# EAGLE design SpeedOfLightController (EAGLE 9.5.1)

## Sheet 1 of 5
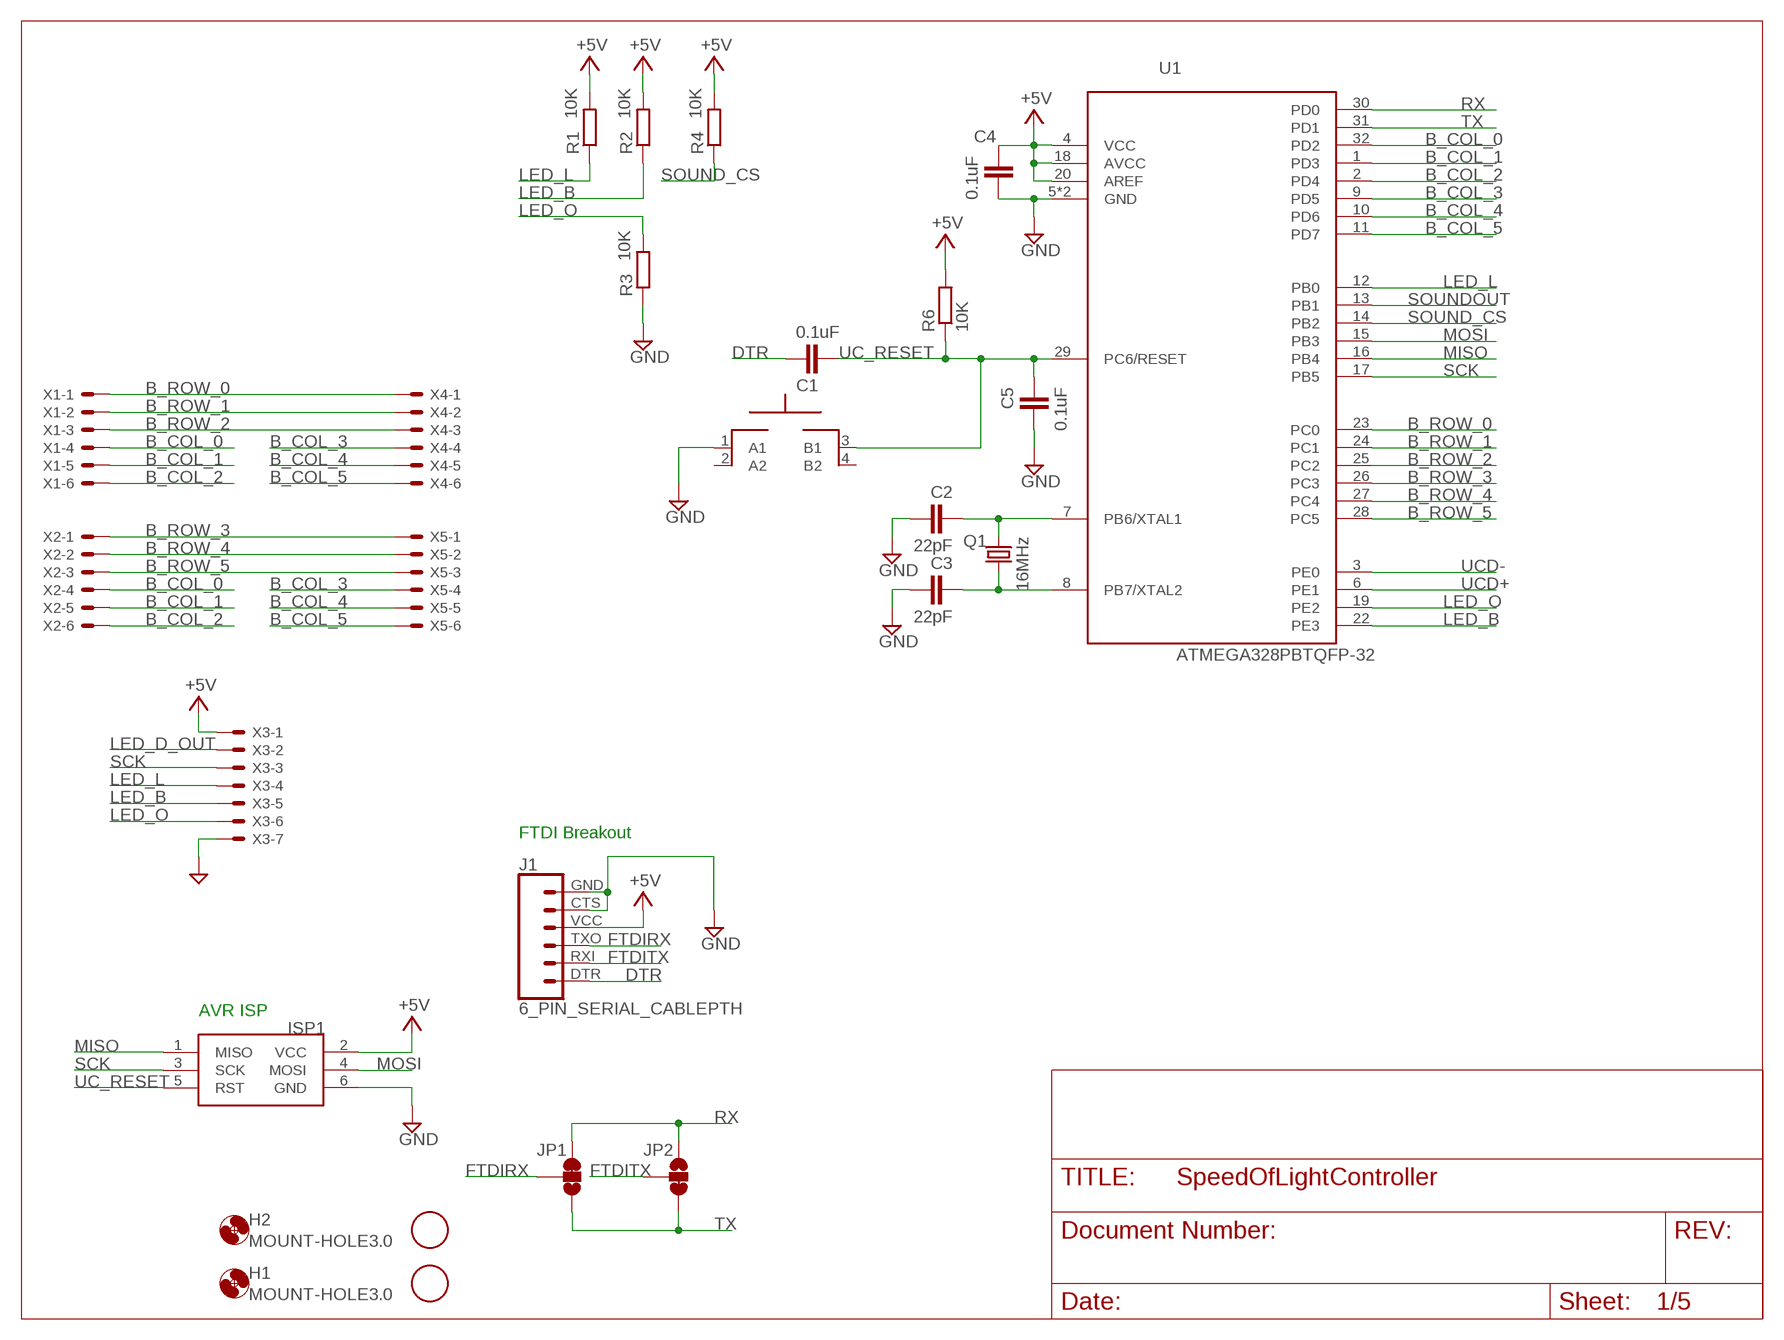
[diagram p0: schematic, sheet 1]

### Parts
AF1  FIDUCIAL  [FIDUCIAL_1MM]
AF2  FIDUCIAL  [FIDUCIAL_1MM]
C1  0.1uF  C-EUC0805  [C0805]
C2  22pF  C-EUC0805  [C0805]
C3  22pF  C-EUC0805  [C0805]
C4  0.1uF  C-EUC0805  [C0805]
C5  0.1uF  C-EUC0805  [C0805]
H1  MOUNT-HOLE3.0  [3,0]
H2  MOUNT-HOLE3.0  [3,0]
ISP1  AVRISP-6  [AVRISP]
J1  6_PIN_SERIAL_CABLEPTH  [FTDI_BASIC]
JP1  JUMPER-SMT_3_1-NC_TRACE_SILK  [SMT-JUMPER_3_1-NC_TRACE_SILK]
JP2  JUMPER-SMT_3_1-NC_TRACE_SILK  [SMT-JUMPER_3_1-NC_TRACE_SILK]
Q1  16MHz  CRYSTALHC49UP  [HC49UP]
R1  10K  R-EU_R0805  [R0805]
R2  10K  R-EU_R0805  [R0805]
R3  10K  R-EU_R0805  [R0805]
R4  10K  R-EU_R0805  [R0805]
R6  10K  R-EU_R0805  [R0805]
RESET  MOMENTARYBUTTON  [SPST_NO_SMD]
U1  ATMEGA328PBTQFP-32  [QFP80P900X900X120-32N]
X1  JST-XH-06-PIN-LONG-PAD  [JST-XH-06-PACKAGE-LONG-PAD]
X2  JST-XH-06-PIN-LONG-PAD  [JST-XH-06-PACKAGE-LONG-PAD]
X3  JST-XH-07-PIN-LONG-PAD  [JST-XH-07-PACKAGE-LONG-PAD]
X4  JST-XH-06-PIN-LONG-PAD  [JST-XH-06-PACKAGE-LONG-PAD]
X5  JST-XH-06-PIN-LONG-PAD  [JST-XH-06-PACKAGE-LONG-PAD]

### Nets
+5V: C4.2 ISP1.2(VCC) J1.VCC R1.2 R2.2 R4.2 R6.2 U1.4(VCC) U1.18(AVCC) U1.20(AREF) X3.1 ; also sheet 2,4,5
B_COL_0: U1.32(PD2) X1.4 X2.4
B_COL_1: U1.1(PD3) X1.5 X2.5
B_COL_2: U1.2(PD4) X1.6 X2.6
B_COL_3: U1.9(PD5) X4.4 X5.4
B_COL_4: U1.10(PD6) X4.5 X5.5
B_COL_5: U1.11(PD7) X4.6 X5.6
B_ROW_0: U1.23(PC0) X1.1 X4.1
B_ROW_1: U1.24(PC1) X1.2 X4.2
B_ROW_2: U1.25(PC2) X1.3 X4.3
B_ROW_3: U1.26(PC3) X2.1 X5.1
B_ROW_4: U1.27(PC4) X2.2 X5.2
B_ROW_5: U1.28(PC5) X2.3 X5.3
DTR: C1.2 J1.DTR
FTDIRX: J1.TXO JP1.2
FTDITX: J1.RXI JP2.2
GND: C2.1 C3.1 C4.1 C5.1 ISP1.6(GND) J1.CTS J1.GND R3.1 RESET.1(A1) U1.5(GND) U1.21(GND) X3.7 ; also sheet 2,3,4,5
LED_B: R2.1 U1.22(PE3) X3.5 ; also sheet 2
LED_D_OUT: X3.2 ; also sheet 2
LED_L: R1.1 U1.12(PB0) X3.4 ; also sheet 2
LED_O: R3.2 U1.19(PE2) X3.6 ; also sheet 2
MISO: ISP1.1(MISO) U1.16(PB4) ; also sheet 4
MOSI: ISP1.4(MOSI) U1.15(PB3) ; also sheet 2,4
N$17: C2.2 Q1.1 U1.7(PB6/XTAL1)
N$18: C3.2 Q1.2 U1.8(PB7/XTAL2)
RX: JP1.3 JP2.1 U1.30(PD0)
SCK: ISP1.3(SCK) U1.17(PB5) X3.3 ; also sheet 2,4
SOUND_CS: R4.1 U1.14(PB2) ; also sheet 4
SOUNDOUT: U1.13(PB1) ; also sheet 4
TX: JP1.1 JP2.3 U1.31(PD1)
UC_RESET: C1.1 C5.2 ISP1.5(RST) R6.1 RESET.3(B1) U1.29(PC6/RESET)
UCD+: U1.6(PE1) ; also sheet 5
UCD-: U1.3(PE0) ; also sheet 5
Unconnected: RESET.2(A2) RESET.4(B2)

### Notes on the sheet
- FTDI Breakout
- AVR ISP

## Sheet 2 of 5: ScoreBoard
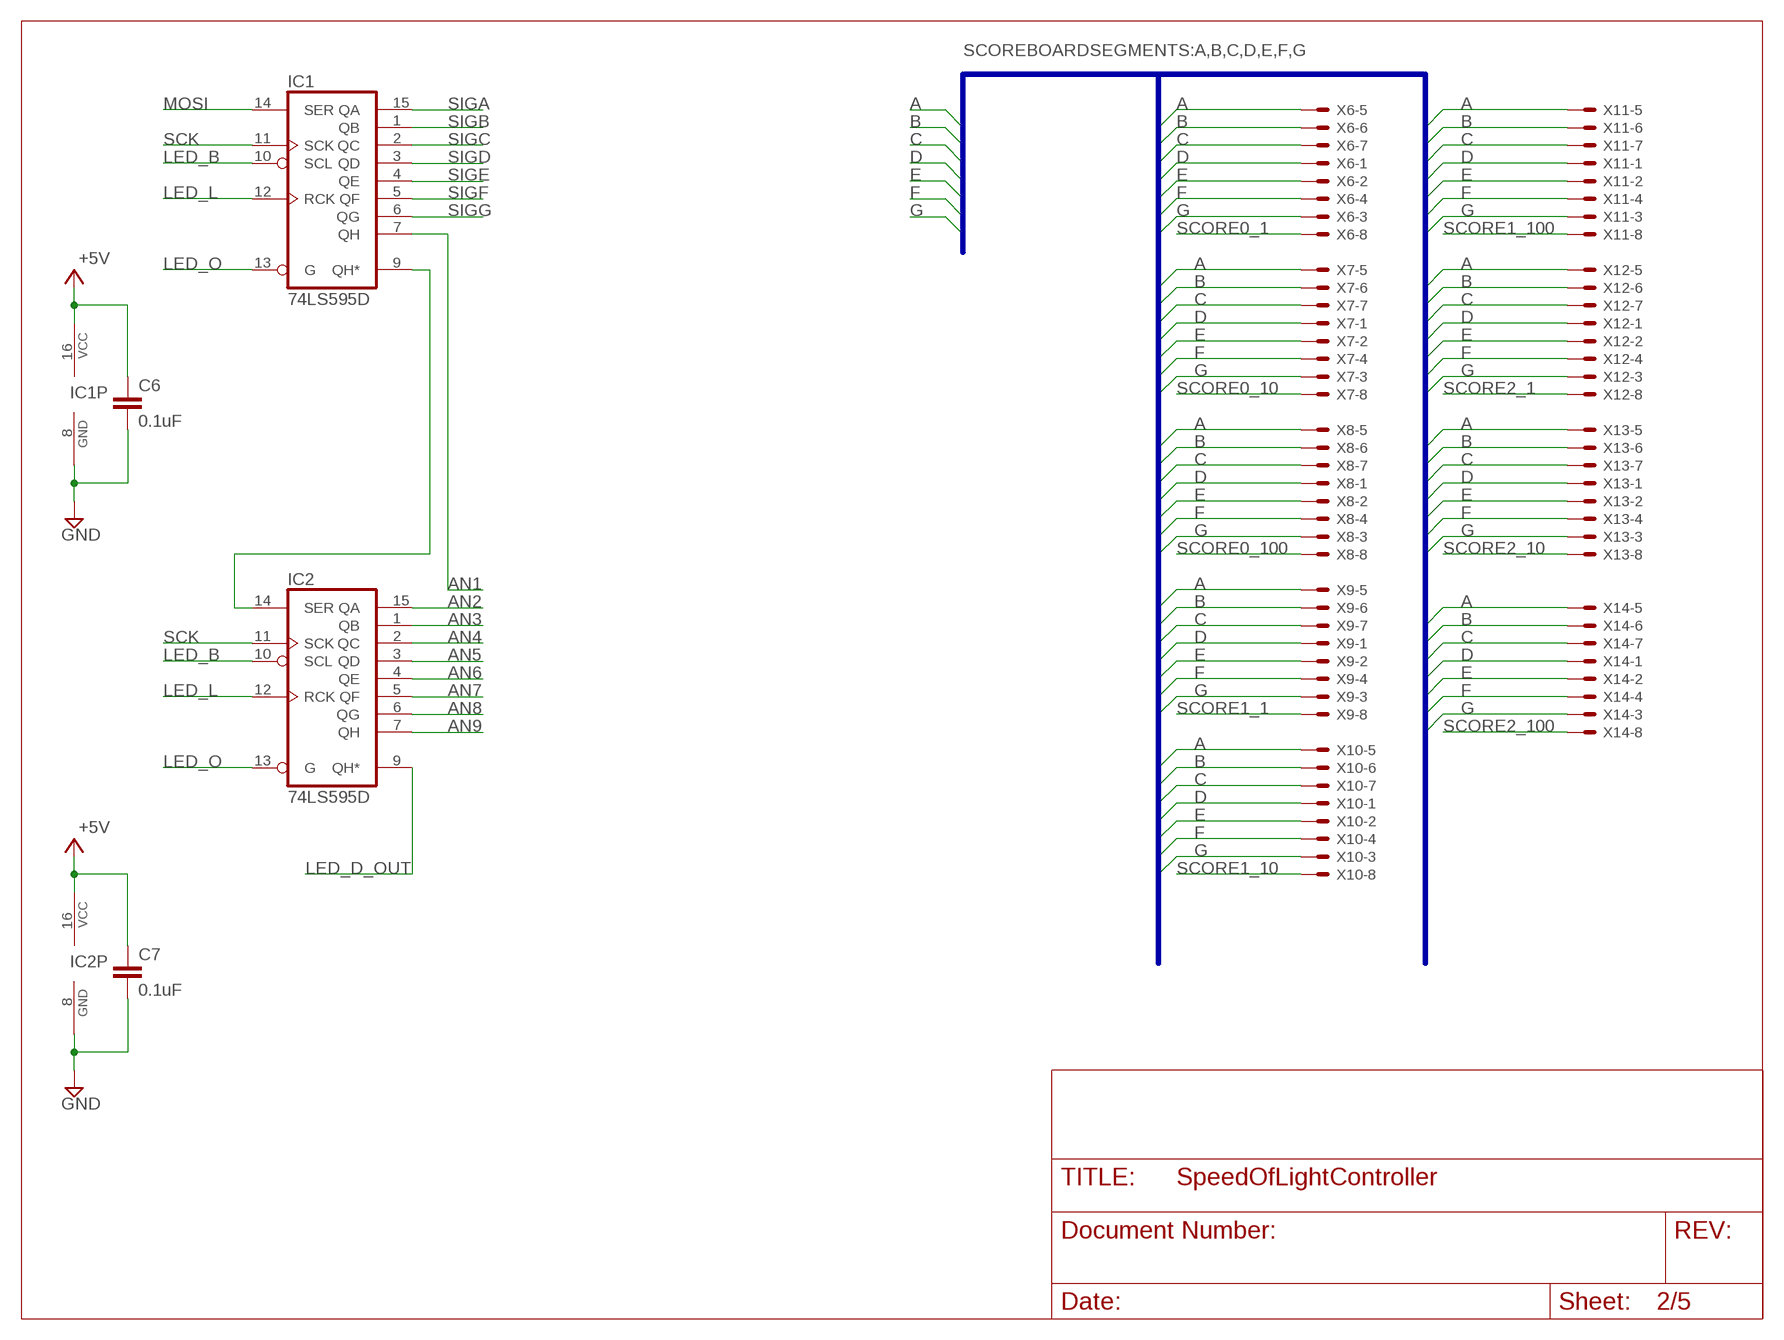
[diagram p1: schematic, sheet 2]

### Parts
C6  0.1uF  C-EUC0805  [C0805]
C7  0.1uF  C-EUC0805  [C0805]
IC1  74LS595D  [SO16]
IC2  74LS595D  [SO16]
X6  JST-XH-08-PIN-LONG-PAD  [JST-XH-08-PACKAGE-LONG-PAD]
X7  JST-XH-08-PIN-LONG-PAD  [JST-XH-08-PACKAGE-LONG-PAD]
X8  JST-XH-08-PIN-LONG-PAD  [JST-XH-08-PACKAGE-LONG-PAD]
X9  JST-XH-08-PIN-LONG-PAD  [JST-XH-08-PACKAGE-LONG-PAD]
X10  JST-XH-08-PIN-LONG-PAD  [JST-XH-08-PACKAGE-LONG-PAD]
X11  JST-XH-08-PIN-LONG-PAD  [JST-XH-08-PACKAGE-LONG-PAD]
X12  JST-XH-08-PIN-LONG-PAD  [JST-XH-08-PACKAGE-LONG-PAD]
X13  JST-XH-08-PIN-LONG-PAD  [JST-XH-08-PACKAGE-LONG-PAD]
X14  JST-XH-08-PIN-LONG-PAD  [JST-XH-08-PACKAGE-LONG-PAD]

### Nets
+5V: C6.1 C7.1 IC1.16(VCC) IC2.16(VCC) ; also sheet 1,4,5
A: X6.5 X7.5 X8.5 X9.5 X10.5 X11.5 X12.5 X13.5 X14.5 ; also sheet 3
AN1: IC1.7(QH) ; also sheet 3
AN2: IC2.15(QA) ; also sheet 3
AN3: IC2.1(QB) ; also sheet 3
AN4: IC2.2(QC) ; also sheet 3
AN5: IC2.3(QD) ; also sheet 3
AN6: IC2.4(QE) ; also sheet 3
AN7: IC2.5(QF) ; also sheet 3
AN8: IC2.6(QG) ; also sheet 3
AN9: IC2.7(QH) ; also sheet 3
B: X6.6 X7.6 X8.6 X9.6 X10.6 X11.6 X12.6 X13.6 X14.6 ; also sheet 3
C: X6.7 X7.7 X8.7 X9.7 X10.7 X11.7 X12.7 X13.7 X14.7 ; also sheet 3
D: X6.1 X7.1 X8.1 X9.1 X10.1 X11.1 X12.1 X13.1 X14.1 ; also sheet 3
E: X6.2 X7.2 X8.2 X9.2 X10.2 X11.2 X12.2 X13.2 X14.2 ; also sheet 3
F: X6.4 X7.4 X8.4 X9.4 X10.4 X11.4 X12.4 X13.4 X14.4 ; also sheet 3
G: X6.3 X7.3 X8.3 X9.3 X10.3 X11.3 X12.3 X13.3 X14.3 ; also sheet 3
GND: C6.2 C7.2 IC1.8(GND) IC2.8(GND) ; also sheet 1,3,4,5
LED_B: IC1.10(SCL) IC2.10(SCL) ; also sheet 1
LED_D_OUT: IC2.9(QH*) ; also sheet 1
LED_L: IC1.12(RCK) IC2.12(RCK) ; also sheet 1
LED_O: IC1.13(G) IC2.13(G) ; also sheet 1
MOSI: IC1.14(SER) ; also sheet 1,4
N$39: IC1.9(QH*) IC2.14(SER)
SCK: IC1.11(SCK) IC2.11(SCK) ; also sheet 1,4
SCORE0_1: X6.8 ; also sheet 3
SCORE0_10: X7.8 ; also sheet 3
SCORE0_100: X8.8 ; also sheet 3
SCORE1_1: X9.8 ; also sheet 3
SCORE1_10: X10.8 ; also sheet 3
SCORE1_100: X11.8 ; also sheet 3
SCORE2_1: X12.8 ; also sheet 3
SCORE2_10: X13.8 ; also sheet 3
SCORE2_100: X14.8 ; also sheet 3
SIGA: IC1.15(QA) ; also sheet 3
SIGB: IC1.1(QB) ; also sheet 3
SIGC: IC1.2(QC) ; also sheet 3
SIGD: IC1.3(QD) ; also sheet 3
SIGE: IC1.4(QE) ; also sheet 3
SIGF: IC1.5(QF) ; also sheet 3
SIGG: IC1.6(QG) ; also sheet 3

### Buses
SCOREBOARDSEGMENTS:A,B,C,D,E,F,G

## Sheet 3 of 5: Scoreboard switches
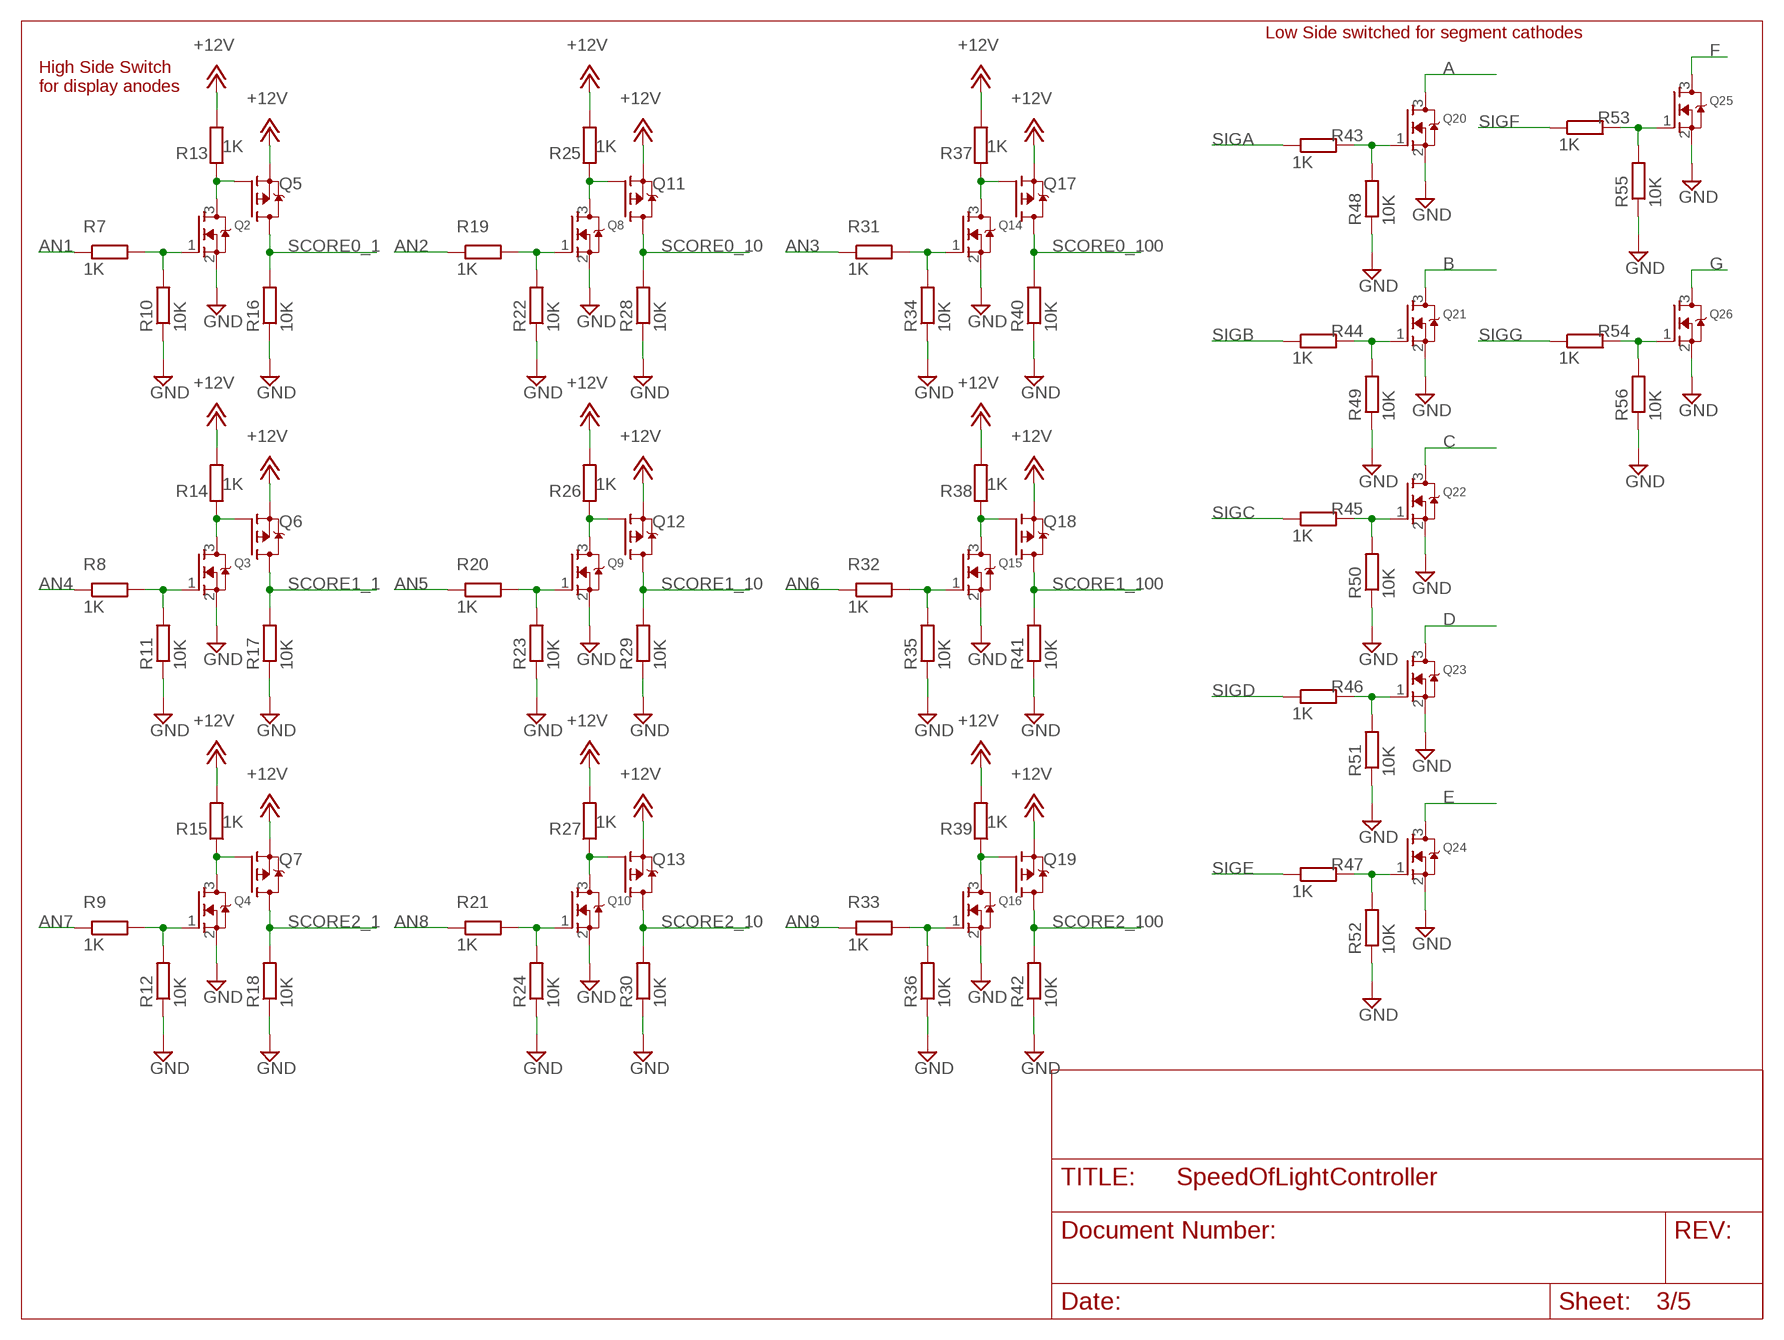
[diagram p2: schematic, sheet 3]

### Parts
Q2  AO3414SOT23  [SOT95P240X110-3N]
Q3  AO3414SOT23  [SOT95P240X110-3N]
Q4  AO3414SOT23  [SOT95P240X110-3N]
Q5  AO3415  [SOT95P240X110-3N]
Q6  AO3415  [SOT95P240X110-3N]
Q7  AO3415  [SOT95P240X110-3N]
Q8  AO3414SOT23  [SOT95P240X110-3N]
Q9  AO3414SOT23  [SOT95P240X110-3N]
Q10  AO3414SOT23  [SOT95P240X110-3N]
Q11  AO3415  [SOT95P240X110-3N]
Q12  AO3415  [SOT95P240X110-3N]
Q13  AO3415  [SOT95P240X110-3N]
Q14  AO3414SOT23  [SOT95P240X110-3N]
Q15  AO3414SOT23  [SOT95P240X110-3N]
Q16  AO3414SOT23  [SOT95P240X110-3N]
Q17  AO3415  [SOT95P240X110-3N]
Q18  AO3415  [SOT95P240X110-3N]
Q19  AO3415  [SOT95P240X110-3N]
Q20  AO3414SOT23  [SOT95P240X110-3N]
Q21  AO3414SOT23  [SOT95P240X110-3N]
Q22  AO3414SOT23  [SOT95P240X110-3N]
Q23  AO3414SOT23  [SOT95P240X110-3N]
Q24  AO3414SOT23  [SOT95P240X110-3N]
Q25  AO3414SOT23  [SOT95P240X110-3N]
Q26  AO3414SOT23  [SOT95P240X110-3N]
R7  1K  R-EU_R0805  [R0805]
R8  1K  R-EU_R0805  [R0805]
R9  1K  R-EU_R0805  [R0805]
R10  10K  R-EU_R0805  [R0805]
R11  10K  R-EU_R0805  [R0805]
R12  10K  R-EU_R0805  [R0805]
R13  1K  R-EU_R0805  [R0805]
R14  1K  R-EU_R0805  [R0805]
R15  1K  R-EU_R0805  [R0805]
R16  10K  R-EU_R0805  [R0805]
R17  10K  R-EU_R0805  [R0805]
R18  10K  R-EU_R0805  [R0805]
R19  1K  R-EU_R0805  [R0805]
R20  1K  R-EU_R0805  [R0805]
R21  1K  R-EU_R0805  [R0805]
R22  10K  R-EU_R0805  [R0805]
R23  10K  R-EU_R0805  [R0805]
R24  10K  R-EU_R0805  [R0805]
R25  1K  R-EU_R0805  [R0805]
R26  1K  R-EU_R0805  [R0805]
R27  1K  R-EU_R0805  [R0805]
R28  10K  R-EU_R0805  [R0805]
R29  10K  R-EU_R0805  [R0805]
R30  10K  R-EU_R0805  [R0805]
R31  1K  R-EU_R0805  [R0805]
R32  1K  R-EU_R0805  [R0805]
R33  1K  R-EU_R0805  [R0805]
R34  10K  R-EU_R0805  [R0805]
R35  10K  R-EU_R0805  [R0805]
R36  10K  R-EU_R0805  [R0805]
R37  1K  R-EU_R0805  [R0805]
R38  1K  R-EU_R0805  [R0805]
R39  1K  R-EU_R0805  [R0805]
R40  10K  R-EU_R0805  [R0805]
R41  10K  R-EU_R0805  [R0805]
R42  10K  R-EU_R0805  [R0805]
R43  1K  R-EU_R0805  [R0805]
R44  1K  R-EU_R0805  [R0805]
R45  1K  R-EU_R0805  [R0805]
R46  1K  R-EU_R0805  [R0805]
R47  1K  R-EU_R0805  [R0805]
R48  10K  R-EU_R0805  [R0805]
R49  10K  R-EU_R0805  [R0805]
R50  10K  R-EU_R0805  [R0805]
R51  10K  R-EU_R0805  [R0805]
R52  10K  R-EU_R0805  [R0805]
R53  1K  R-EU_R0805  [R0805]
R54  1K  R-EU_R0805  [R0805]
R55  10K  R-EU_R0805  [R0805]
R56  10K  R-EU_R0805  [R0805]

### Nets
+12V [power]: Q5.2(S) Q6.2(S) Q7.2(S) Q11.2(S) Q12.2(S) Q13.2(S) Q17.2(S) Q18.2(S) Q19.2(S) R13.2 R14.2 R15.2 R25.2 R26.2 R27.2 R37.2 R38.2 R39.2 ; also sheet 5
A: Q20.3(D) ; also sheet 2
AN1: R7.1 ; also sheet 2
AN2: R19.1 ; also sheet 2
AN3: R31.1 ; also sheet 2
AN4: R8.1 ; also sheet 2
AN5: R20.1 ; also sheet 2
AN6: R32.1 ; also sheet 2
AN7: R9.1 ; also sheet 2
AN8: R21.1 ; also sheet 2
AN9: R33.1 ; also sheet 2
B: Q21.3(D) ; also sheet 2
C: Q22.3(D) ; also sheet 2
D: Q23.3(D) ; also sheet 2
E: Q24.3(D) ; also sheet 2
F: Q25.3(D) ; also sheet 2
G: Q26.3(D) ; also sheet 2
GND: Q2.2(S) Q3.2(S) Q4.2(S) Q8.2(S) Q9.2(S) Q10.2(S) Q14.2(S) Q15.2(S) Q16.2(S) Q20.2(S) Q21.2(S) Q22.2(S) Q23.2(S) Q24.2(S) Q25.2(S) Q26.2(S) R10.1 R11.1 R12.1 R16.1 R17.1 R18.1 R22.1 R23.1 R24.1 R28.1 R29.1 R30.1 R34.1 R35.1 R36.1 R40.1 R41.1 R42.1 R48.1 R49.1 R50.1 R51.1 R52.1 R55.1 R56.1 ; also sheet 1,2,4,5
N$1: Q21.1(G) R44.2 R49.2
N$2: Q22.1(G) R45.2 R50.2
N$3: Q23.1(G) R46.2 R51.2
N$4: Q24.1(G) R47.2 R52.2
N$5: Q20.1(G) R43.2 R48.2
N$6: Q25.1(G) R53.2 R55.2
N$7: Q26.1(G) R54.2 R56.2
N$8: Q2.1(G) R7.2 R10.2
N$9: Q8.1(G) R19.2 R22.2
N$10: Q14.1(G) R31.2 R34.2
N$11: Q3.1(G) R8.2 R11.2
N$12: Q9.1(G) R20.2 R23.2
N$13: Q15.1(G) R32.2 R35.2
N$14: Q4.1(G) R9.2 R12.2
N$15: Q10.1(G) R21.2 R24.2
N$16: Q16.1(G) R33.2 R36.2
N$27: Q16.3(D) Q19.1(G) R39.1
N$28: Q10.3(D) Q13.1(G) R27.1
N$29: Q4.3(D) Q7.1(G) R15.1
N$30: Q3.3(D) Q6.1(G) R14.1
N$34: Q9.3(D) Q12.1(G) R26.1
N$35: Q15.3(D) Q18.1(G) R38.1
N$36: Q14.3(D) Q17.1(G) R37.1
N$37: Q8.3(D) Q11.1(G) R25.1
N$38: Q2.3(D) Q5.1(G) R13.1
SCORE0_1: Q5.3(D) R16.2 ; also sheet 2
SCORE0_10: Q11.3(D) R28.2 ; also sheet 2
SCORE0_100: Q17.3(D) R40.2 ; also sheet 2
SCORE1_1: Q6.3(D) R17.2 ; also sheet 2
SCORE1_10: Q12.3(D) R29.2 ; also sheet 2
SCORE1_100: Q18.3(D) R41.2 ; also sheet 2
SCORE2_1: Q7.3(D) R18.2 ; also sheet 2
SCORE2_10: Q13.3(D) R30.2 ; also sheet 2
SCORE2_100: Q19.3(D) R42.2 ; also sheet 2
SIGA: R43.1 ; also sheet 2
SIGB: R44.1 ; also sheet 2
SIGC: R45.1 ; also sheet 2
SIGD: R46.1 ; also sheet 2
SIGE: R47.1 ; also sheet 2
SIGF: R53.1 ; also sheet 2
SIGG: R54.1 ; also sheet 2

### Notes on the sheet
- Low Side switched for segment cathodes
- High Side Switch 
  for display anodes

## Sheet 4 of 5: Sound
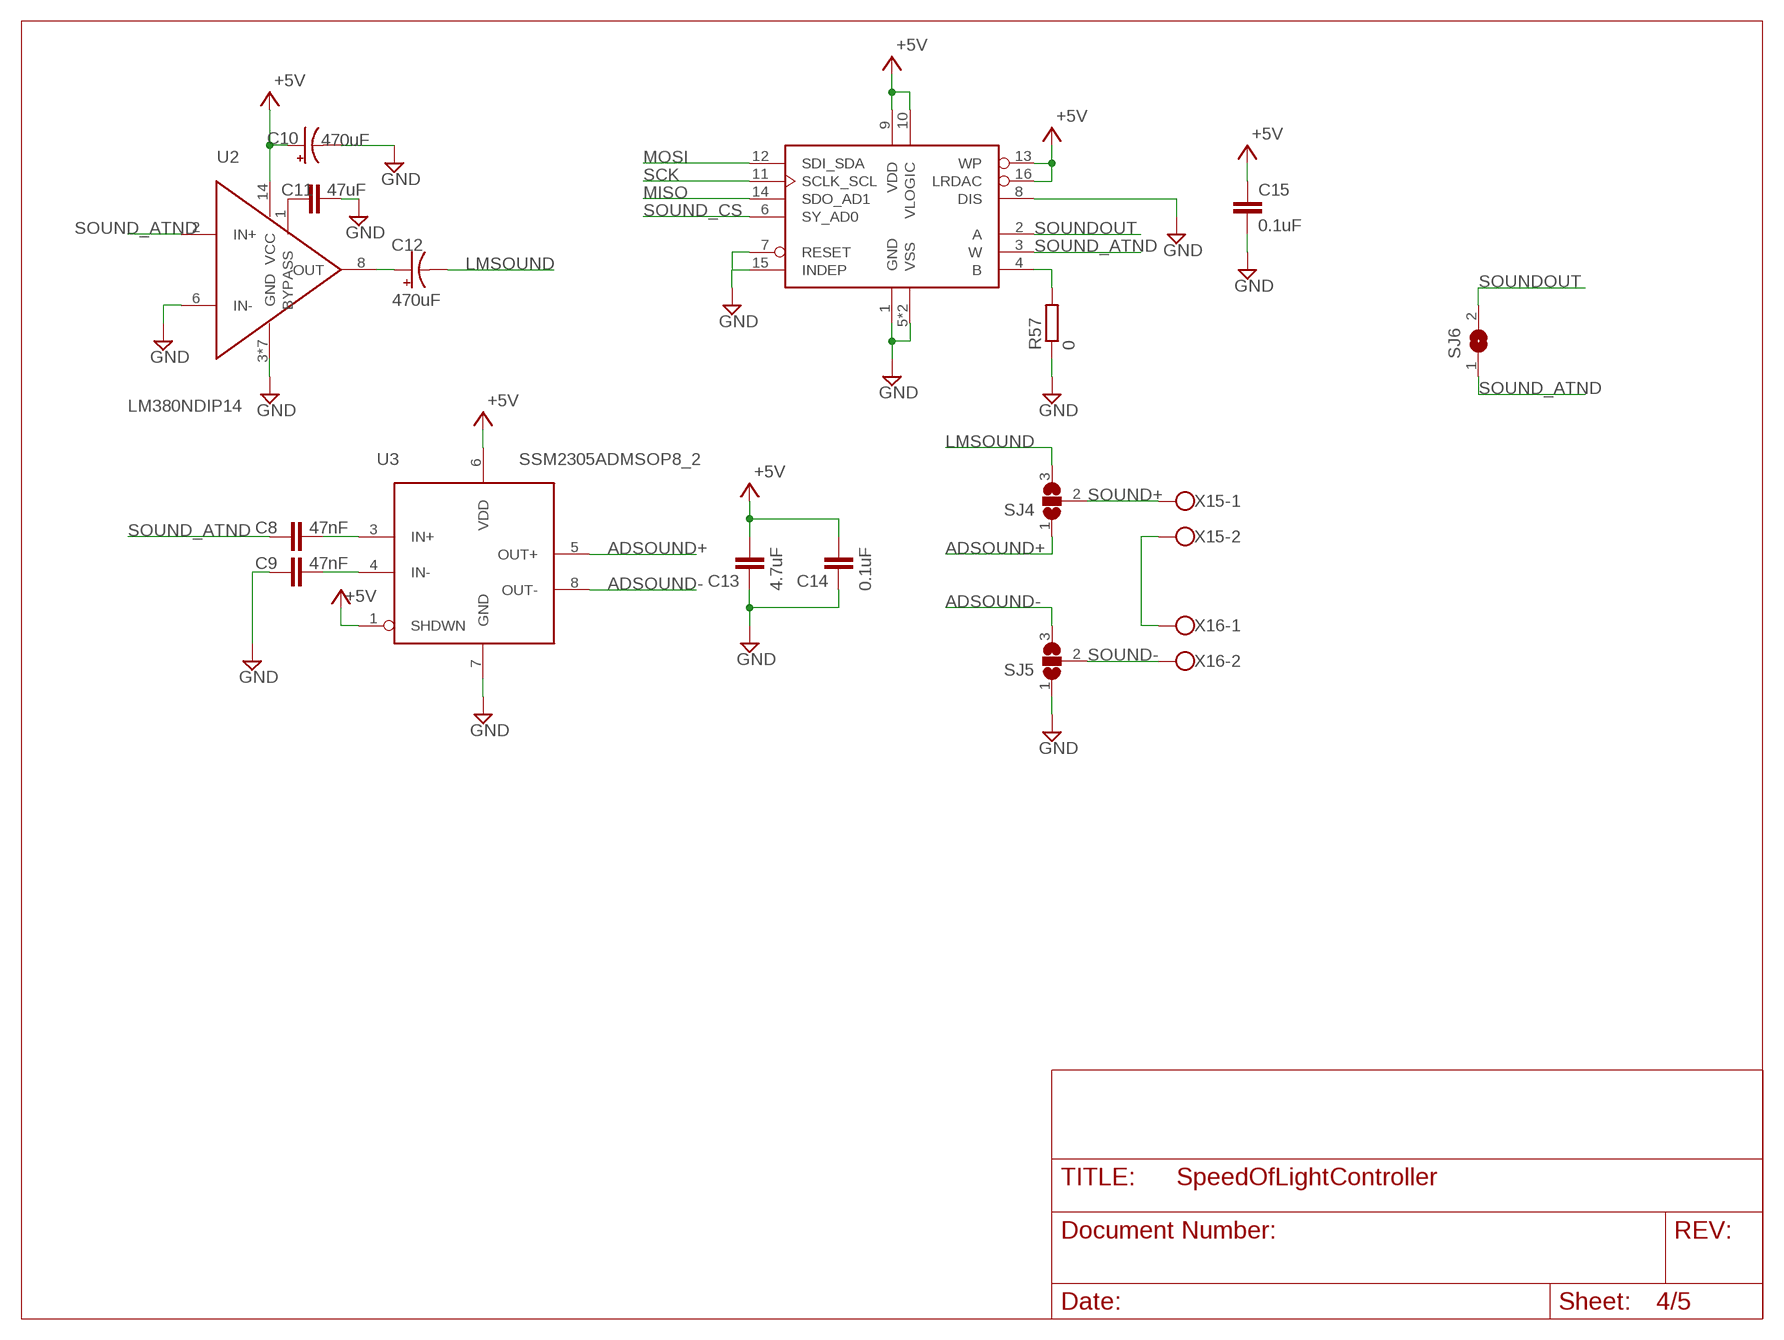
[diagram p3: schematic, sheet 4]

### Parts
C8  47nF  C-EUC0805  [C0805]
C9  47nF  C-EUC0805  [C0805]
C10  470uF  CPOL-US140CLH-0810  [140CLH-0810]
C11  47uF  C-EUC0805  [C0805]
C12  470uF  CPOL-US140CLH-0810  [140CLH-0810]
C13  4.7uF  C-EUC0805  [C0805]
C14  0.1uF  C-EUC0805  [C0805]
C15  0.1uF  C-EUC0805  [C0805]
R57  0  R-EU_R0805W  [R0805W]
SJ4  SJ2W  [SJ_2]
SJ5  SJ2W  [SJ_2]
SJ6  SJ  [SJ]
U2  LM380NDIP14  [DIP762W53P254L1969H508Q14B]
U3  SSM2305ADMSOP8_2  [SOP65P490X95-8N]
U4  AD5141ADLFCSP3  [QFN50P300X300X80-17T160N]
X15  1X02_5MM_SCREW  [W237-102]
X16  1X02_5MM_SCREW  [W237-102]

### Nets
+5V: C10.+ C13.2 C14.2 C15.1 U2.14(VCC) U3.1(SHDWN) U3.6(VDD) U4.9(VDD) U4.10(VLOGIC) U4.13(WP) U4.16(LRDAC) ; also sheet 1,2,5
ADSOUND+: SJ4.1 U3.5(OUT+)
ADSOUND-: SJ5.3 U3.8(OUT-)
GND: C9.1 C10.- C11.2 C13.1 C14.1 C15.2 R57.1 SJ5.1 U2.3(GND) U2.4(GND) U2.5(GND) U2.6(IN-) U2.7(GND) U2.10(GND) U2.11(GND) U2.12(GND) U3.7(GND) U4.1(GND) U4.5(VSS) U4.7(RESET) U4.8(DIS) U4.15(INDEP) U4.17(VSS) ; also sheet 1,2,3,5
LMSOUND: C12.- SJ4.3
MISO: U4.14(SDO_AD1) ; also sheet 1
MOSI: U4.12(SDI_SDA) ; also sheet 1,2
N$20: X15.2 X16.1
N$21: C12.+ U2.8(OUT)
N$22: C11.1 U2.1(BYPASS)
N$23: C9.2 U3.4(IN-)
N$24: C8.2 U3.3(IN+)
N$25: R57.2 U4.4(B)
SCK: U4.11(SCLK_SCL) ; also sheet 1,2
SOUND+: SJ4.2 X15.1
SOUND-: SJ5.2 X16.2
SOUND_ATND: C8.1 SJ6.1 U2.2(IN+) U4.3(W)
SOUND_CS: U4.6(SY_AD0) ; also sheet 1
SOUNDOUT: SJ6.2 U4.2(A) ; also sheet 1

## Sheet 5 of 5: POWER
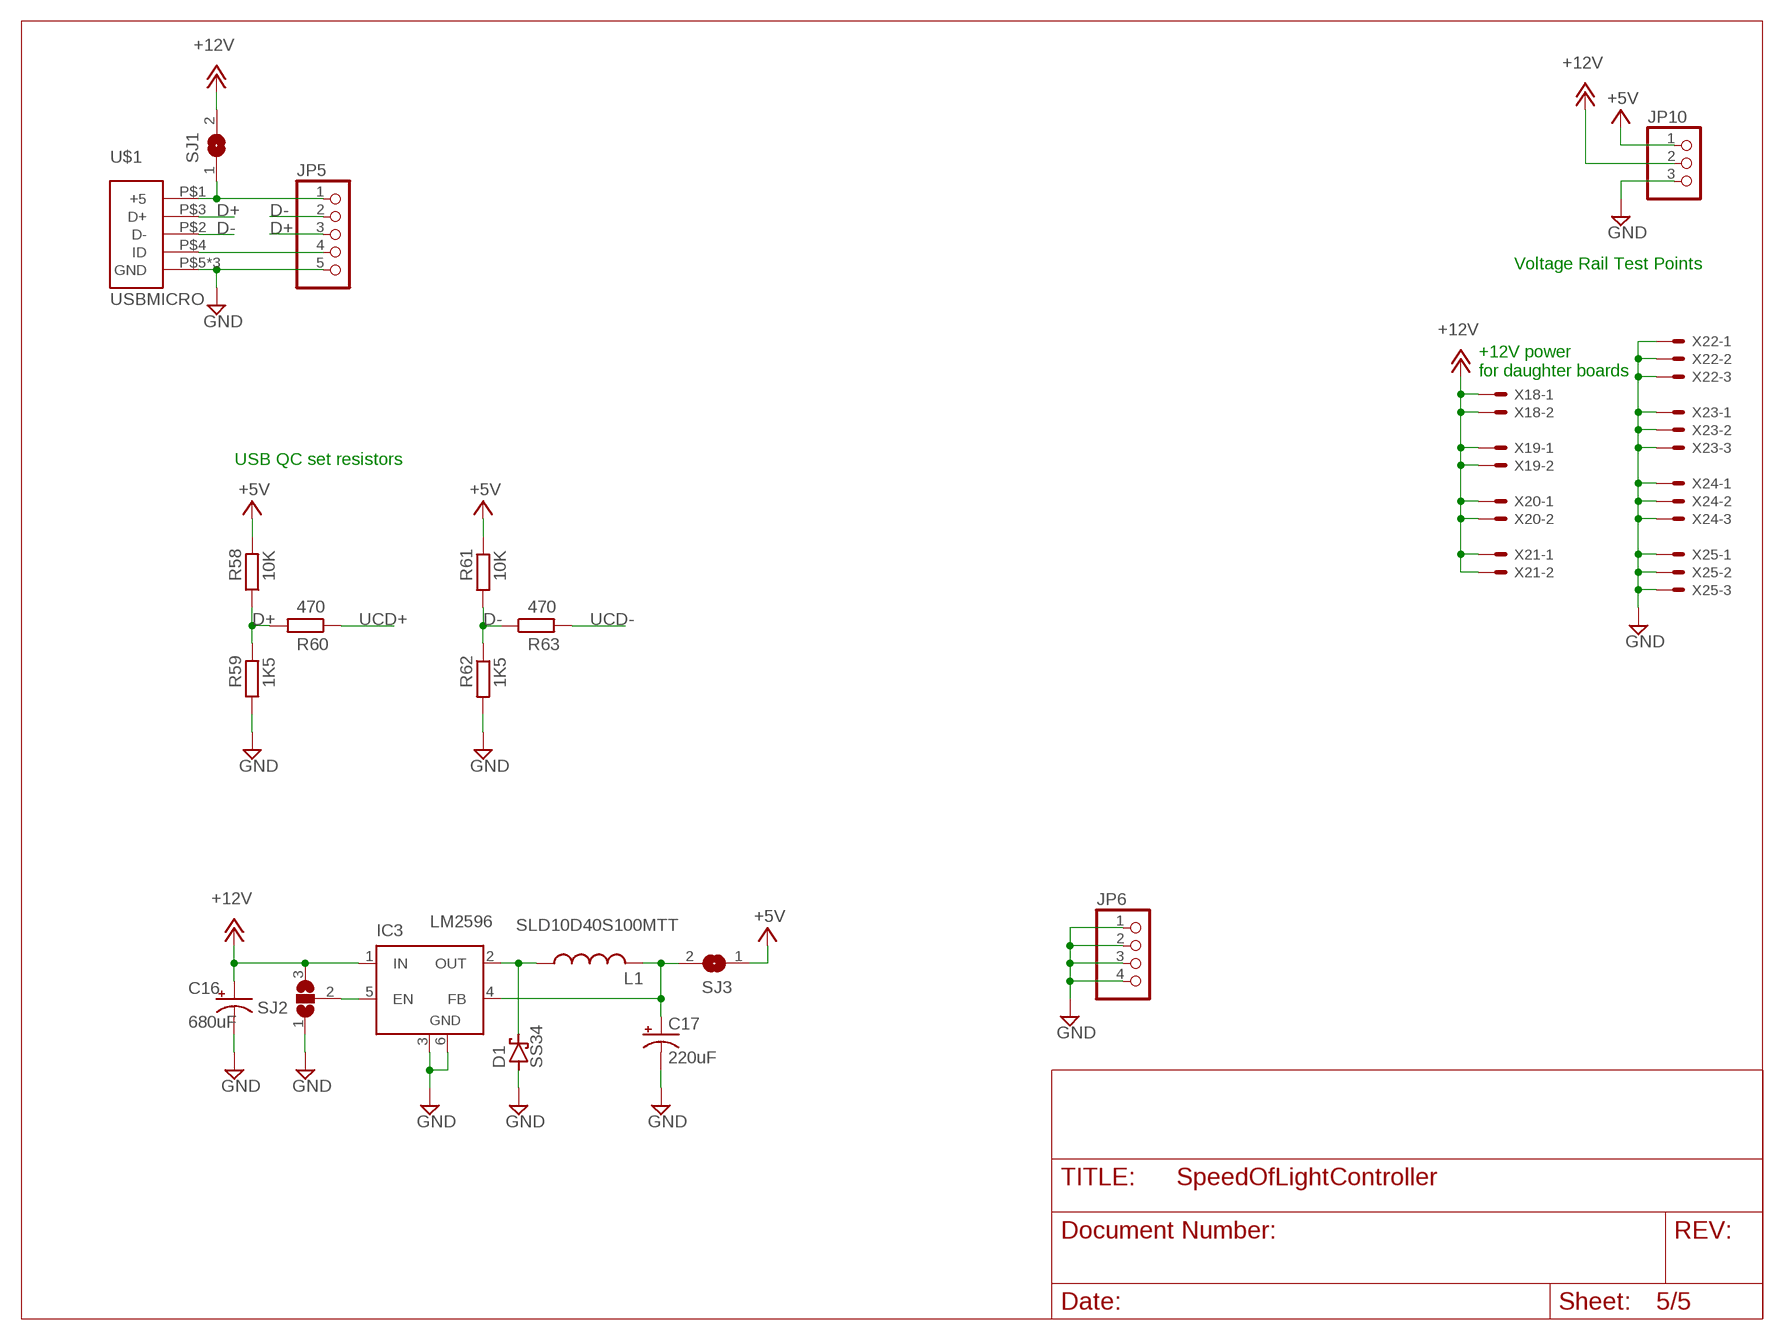
[diagram p4: schematic, sheet 5]

### Parts
C16  680uF  CPOL-US140CLH-0810  [140CLH-0810]
C17  220uF  CPOL-US140CLH-0810  [140CLH-0810]
D1  SS34  [SMA]
IC3  LM2596S  [TO263-5]
JP5  PINHD-1X5  [1X05]
JP6  PINHD-1X4  [1X04]
JP10  PINHD-1X3  [1X03]
L1  SLD10D40S100MTT  [SMD10.5X10.3]
R58  10K  R-EU_R0805  [R0805]
R59  1K5  R-EU_R0805  [R0805]
R60  470  R-EU_R0805  [R0805]
R61  10K  R-EU_R0805  [R0805]
R62  1K5  R-EU_R0805  [R0805]
R63  470  R-EU_R0805  [R0805]
SJ1  SJ  [SJ]
SJ2  SJ2WW  [SJ_2W]
SJ3  SJ  [SJ]
U$1  USBMICRO  [USBMICRO]
X18  JST-XH-02-PIN-LONG-PAD  [JST-XH-02-PACKAGE-LONG-PAD]
X19  JST-XH-02-PIN-LONG-PAD  [JST-XH-02-PACKAGE-LONG-PAD]
X20  JST-XH-02-PIN-LONG-PAD  [JST-XH-02-PACKAGE-LONG-PAD]
X21  JST-XH-02-PIN-LONG-PAD  [JST-XH-02-PACKAGE-LONG-PAD]
X22  JST-XH-03-PIN-LONG-PAD  [JST-XH-03-PACKAGE-LONG-PAD]
X23  JST-XH-03-PIN-LONG-PAD  [JST-XH-03-PACKAGE-LONG-PAD]
X24  JST-XH-03-PIN-LONG-PAD  [JST-XH-03-PACKAGE-LONG-PAD]
X25  JST-XH-03-PIN-LONG-PAD  [JST-XH-03-PACKAGE-LONG-PAD]

### Nets
+5V: JP10.1 R58.2 R61.1 SJ3.1 ; also sheet 1,2,4
+12V [power]: C16.+ IC3.1(IN) JP10.2 SJ1.2 SJ2.3 X18.1 X18.2 X19.1 X19.2 X20.1 X20.2 X21.1 X21.2 ; also sheet 3
D+: JP5.3 R58.1 R59.2 R60.2 U$1.P$3(D+)
D-: JP5.2 R61.2 R62.1 R63.1 U$1.P$2(D-)
GND: C16.- C17.- D1.A IC3.3(GND) IC3.6(GND) JP5.5 JP6.1 JP6.2 JP6.3 JP6.4 JP10.3 R59.1 R62.2 SJ2.1 U$1.P$5(GND) U$1.P$6(GND) U$1.P$8(GND) X22.1 X22.2 X22.3 X23.1 X23.2 X23.3 X24.1 X24.2 X24.3 X25.1 X25.2 X25.3 ; also sheet 1,2,3,4
N$19 [power]: JP5.1 SJ1.1 U$1.P$1(+5)
N$31: JP5.4 U$1.P$4(ID)
N$32: D1.C IC3.2(OUT) L1.P$1
N$40: IC3.5(EN) SJ2.2
N$41: C17.+ IC3.4(FB) L1.P$2 SJ3.2
UCD+: R60.1 ; also sheet 1
UCD-: R63.2 ; also sheet 1

### Notes on the sheet
- Voltage Rail Test Points
- +12V power
  for daughter boards
- USB QC set resistors
- LM2596

## Library data of the parts
AF1 AF2 = ECE388:FIDUCIAL: For use by pick and place machines to calibrate the vision/machine, 1mm By microbuilder.eu
C1-C9 C11 C13-C15 = rcl:C-EU: CAPACITOR, European symbol; SPICEPREFIX: C
C10 C12 C16 C17 = rcl:CPOL-US: POLARIZED CAPACITOR, American symbol; SPICEPREFIX: C
D1 = tmc:SS34
H1 H2 = holes:MOUNT-HOLE: MOUNTING HOLE with drill center marker
IC1 IC2 = 74xx-us:74*595: 8-bit SHIFT REGISTER, output latch
IC3 = linear:LM2596S: STEP-DOWN VOLTAGE REGULATOR
ISP1 = ECE388:AVRISP: AVR ISP HEADER Standard 6 pin header for AVR programming
J1 = SparkFun-Connectors:6_PIN_SERIAL_CABLE: 6-pin header connection for use with the "FTDI BASIC" pinout - CABLE SIDE. Also known as "Arduino Serial Program Header". This is used on a design to provide a 6-pin connection point for serial communication usually from a USB cable (D+/D-) to these headers (RX/TX). It also has the remaining pins necessary for programming in the Arduino evironment (DTR, GND, and sometimes VCC). Note, this device has "CABLE" in the name. It is intended to be used on a design that usually lives on the end of your USB cable and prvides the converter chip (FTDI232 or FTDI231x) to commnicate serial RX/TX. The "sister" device, named "TARGET" is inteneded to be used on a design that contains a target micro-controller that you wish to program. You can populate with some of these: Female Headers <https://www.sparkfun.com/products/115> (PRT-00115) For reference (or to suit your programming needs) check out these designs: SparkFun FTDI Basic Breakout - 5V <https://www.sparkfun.com/products/9716> (DEV-09716) SparkFun FTDI Basic Breakout - 3.3V <https://www.sparkfun.com/products/9873> (DEV-09873) SparkFun FTDI SmartBasic <https://www.sparkfun.com/products/12935> (DEV-12935) SparkFun Beefy 3 - FTDI Basic Breakout <https://www.sparkfun.com/products/13746> (DEV-13746)
JP1 JP2 = SparkFun-Jumpers:JUMPER-SMT_3_1-NC_TRACE: Normally closed trace jumper (1 of 2 connections) This jumper has a trace between two pads so it's normally closed (NC). The other connection is normally open (NO). Use a razor knife to open the connection. For best results follow the IPC guidelines for cutting traces: Cutout at least 0.063 mm (0.005 in). Remove all loose material to clean up the cut area. Seal the cut with an approved epoxy. Reapply solder to reclose the connection, or to close the NO connection.
JP5 = pinhead:PINHD-1X5: PIN HEADER
JP6 = pinhead:PINHD-1X4: PIN HEADER
JP10 = pinhead:PINHD-1X3: PIN HEADER
L1 = tmc:SLD10D40S100MTT
Q1 = crystal:CRYSTAL: CRYSTAL; OC_FARNELL: unknown; OC_NEWARK: unknown
Q2-Q4 Q8-Q10 Q14-Q16 Q20-Q26 = tmc:AO3414
Q5-Q7 Q11-Q13 Q17-Q19 = tmc:AO3415
R1-R4 R6-R63 = rcl:R-EU_: RESISTOR, European symbol; SPICEPREFIX: R
RESET = ECE388:MOMENTARYBUTTON
SJ1 SJ3 SJ6 = ECE388:SJ: SMD solder JUMPER
SJ2 SJ4 SJ5 = jumper:SJ2W: SMD solder JUMPER
U1 = tmc:ATMEGA328PB
U2 = tmc:LM380N
U3 = tmc:SSM2305
U4 = tmc:AD5141
U$1 = tmc:USBMICRO
X1 X2 X4 X5 = Rembrandt Electronics - JST XH Connectors v1-0:JST-XH-06-PIN: JST XH Connector 2 Pin Wire to board connector. Pitch: 2,54 mm, (0.100") Number of pins: 6 Created by Rembrandt Electronics www.rembrandtelectronics.com
X3 = Rembrandt Electronics - JST XH Connectors v1-0:JST-XH-07-PIN: JST XH Connector 2 Pin Wire to board connector. Pitch: 2,54 mm, (0.100") Number of pins: 7 Created by Rembrandt Electronics www.rembrandtelectronics.com
X6-X14 = Rembrandt Electronics - JST XH Connectors v1-0:JST-XH-08-PIN: JST XH Connector 2 Pin Wire to board connector. Pitch: 2,54 mm, (0.100") Number of pins: 8 Created by Rembrandt Electronics www.rembrandtelectronics.com
X15 X16 = ECE388:1X02_5MM_SCREW: WAGO SCREW CLAMP; MPN: 237-102; OC_FARNELL: unknown; OC_NEWARK: 70K9898
X18-X21 = Rembrandt Electronics - JST XH Connectors v1-0:JST-XH-02-PIN: JST XH Connector 2 Pin Wire to board connector. Pitch: 2,54 mm, (0.100") Number of pins: 2 Created by Rembrandt Electronics www.rembrandtelectronics.com
X22-X25 = Rembrandt Electronics - JST XH Connectors v1-0:JST-XH-03-PIN: JST XH Connector 2 Pin Wire to board connector. Pitch: 2,54 mm, (0.100") Number of pins: 3 Created by Rembrandt Electronics www.rembrandtelectronics.com

## Net classes
0 default: width 0.203 mm, drill 0.381 mm, clearance 0.203 mm
1 power: width 0.254 mm, drill 0.381 mm, clearance 0.254 mm

## Board
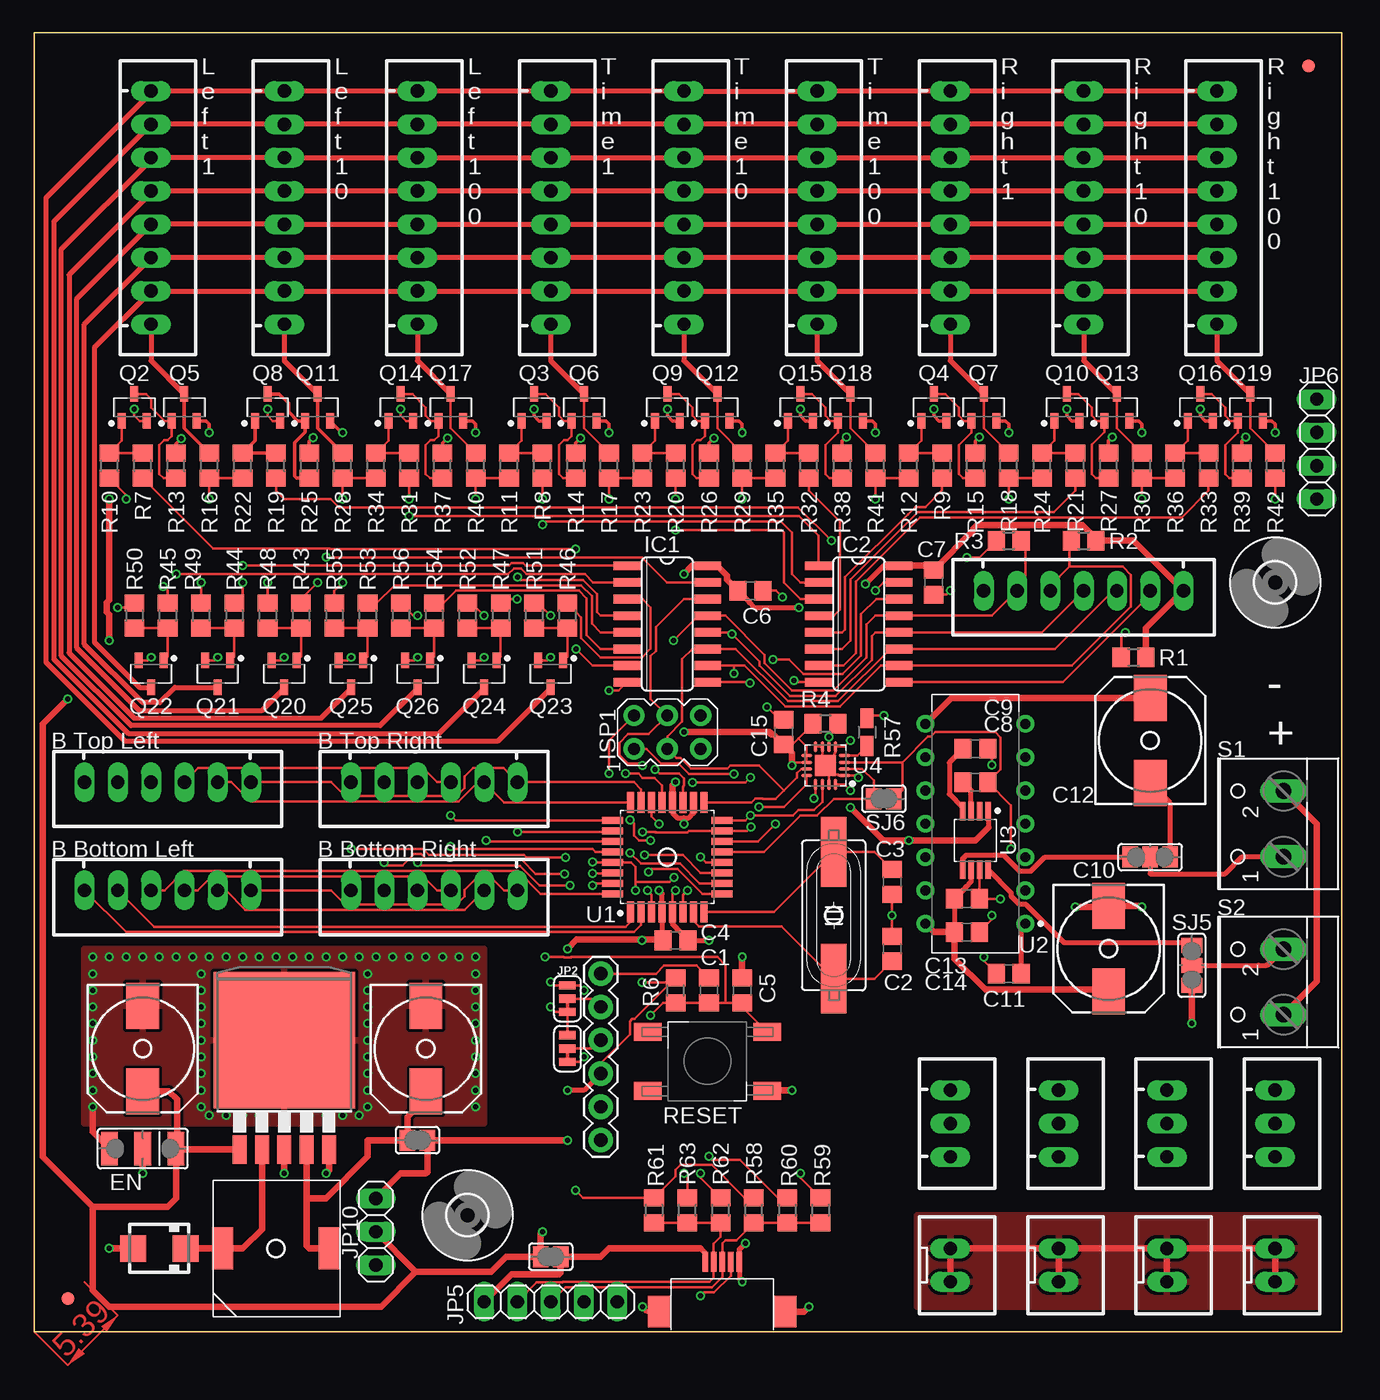
[diagram p5: board, top side]
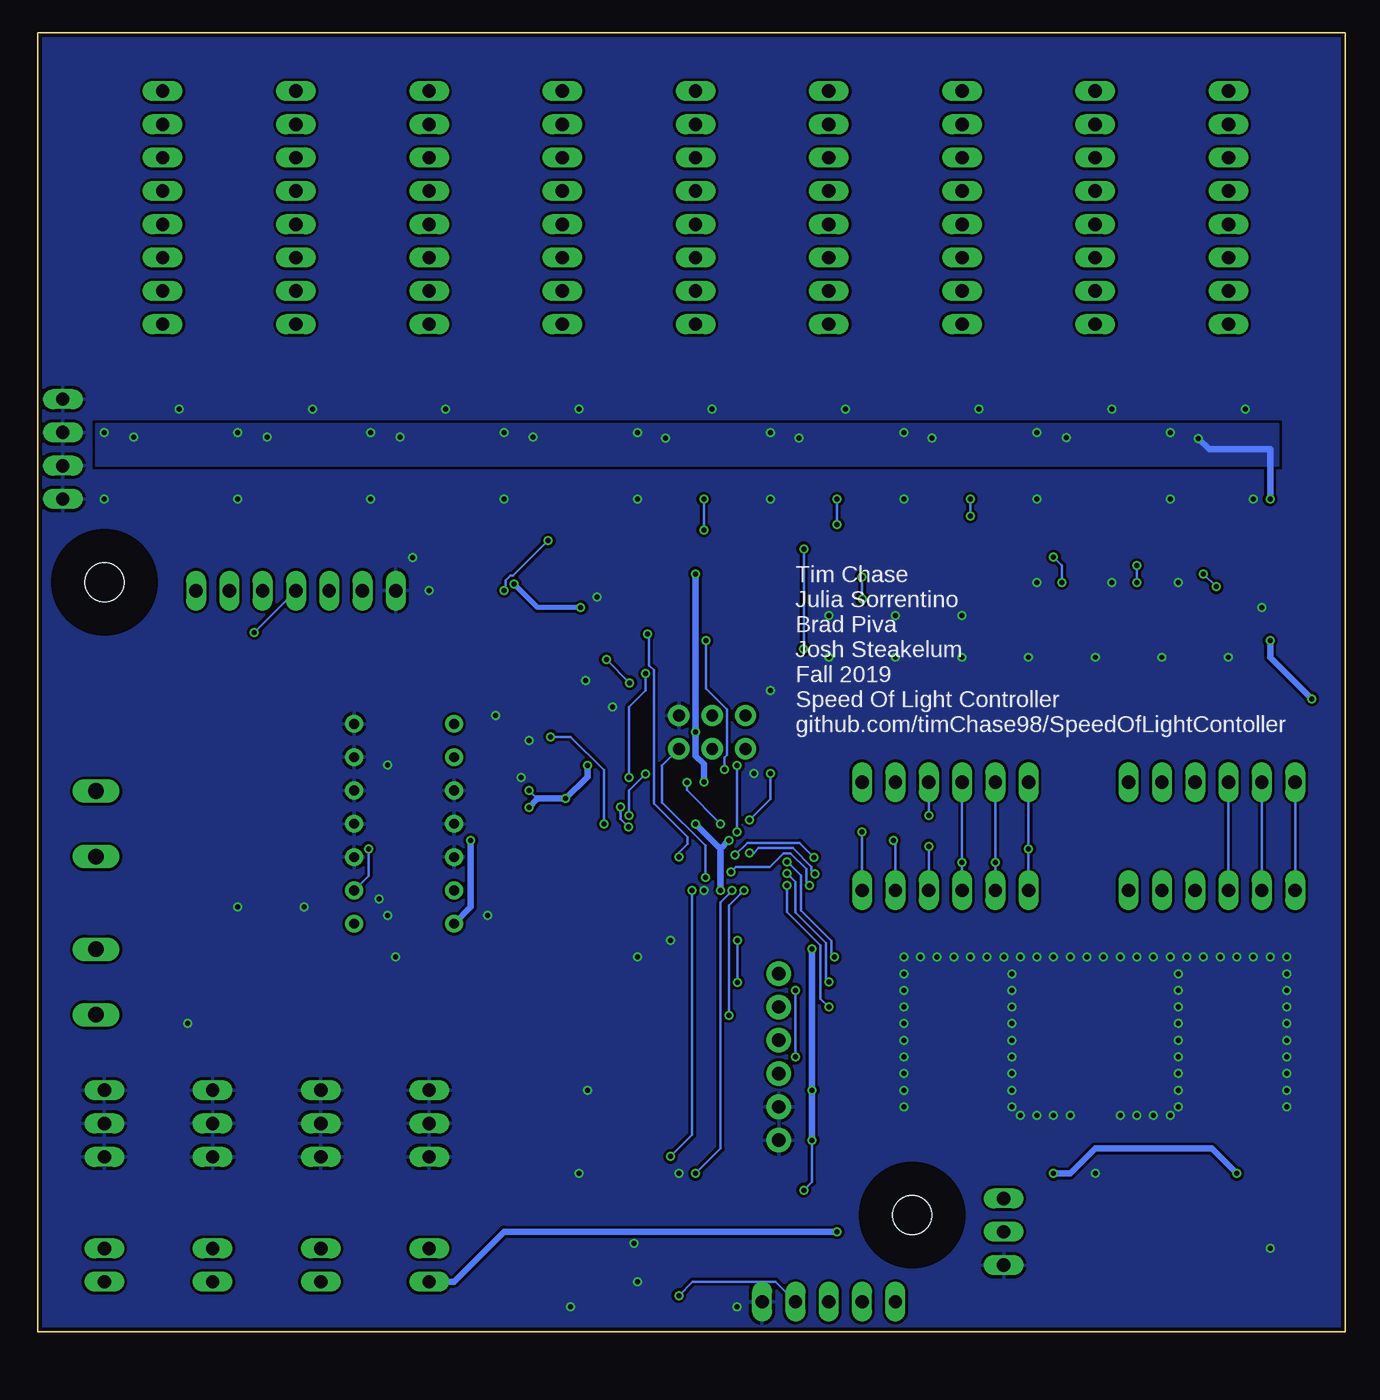
[diagram p6: board, bottom side, seen from below]

Size 99.69 x 99.06 mm. Coordinates in mm from the lower left corner, seen from the top.
Outline: 0,0 0,99.06 99.69,99.06 99.69,0 0,0
Copper layers (1*16): Top 0.035mm / dielectric 1.5mm / Bottom 0.035mm
Design rules "Dirty8TS *": minimum track width 8mil, minimum drill 15mil, track to track 8mil, track to pad 8mil, pad to pad 6mil, via to via 8mil, smd to smd 0mil, copper to edge 10mil, drill to drill 10mil, minimum pad ring 10mil, minimum via ring 6mil, stop-mask expansion 2mil, vias tented up to drill 25mil, thermal gap 10mil

### Footprints (pad centres in the part's own frame; a part is rotated, then mirrored left to right if it is on the bottom)
FIDUCIAL_1MM = smd 1 x 1: 1 0,0
C0805 = smd 1.3 x 1.5: 1 -0.95,0; 2 0.95,0
140CLH-0810 = smd 3.5 x 2.5: + 3.25,0; - -3.25,0
SMA = smd 2 x 2: A 2,0; C -2,0
3,0 = hole 3: 0,0
SO16 = smd 0.66 x 2.032: 1 -4.445,-3.073; 2 -3.175,-3.073; 3 -1.905,-3.073; 4 -0.635,-3.073; 5 0.635,-3.073; 6 1.905,-3.073; 7 3.175,-3.073; 8 4.445,-3.073; 9 4.445,3.073; 10 3.175,3.073; 11 1.905,3.073; 12 0.635,3.073; 13 -0.635,3.073; 14 -1.905,3.073; 15 -3.175,3.073; 16 -4.445,3.073
TO263-5 = smd 1.067 x 2.159: 1 -3.404,-5.791; 2 -1.702,-5.791; 3 0,-5.791; 4 1.702,-5.791; 5 3.404,-5.791 | smd 10.8 x 10.41: 6 0,2.54
AVRISP = drill 0.9 pad 1.626: 1 -1.27,2.54; 2 1.27,2.54; 3 -1.27,0; 4 1.27,0; 5 -1.27,-2.54; 6 1.27,-2.54
FTDI_BASIC = drill 1.016 pad 1.88: CTS 10.16,0; DTR 0,0; GND 12.7,0; RXI 2.54,0; TXO 5.08,0; VCC 7.62,0
SMT-JUMPER_3_1-NC_TRACE_SILK = smd 0.635 x 1.27: 1 -1.016,0; 2 0,0; 3 1.016,0
1X05 = drill 1.016 long: 1 -5.08,0; 2 -2.54,0; 3 0,0; 4 2.54,0; 5 5.08,0
1X04 = drill 1.016 long: 1 -3.81,0; 2 -1.27,0; 3 1.27,0; 4 3.81,0
1X03 = drill 1.016 long: 1 -2.54,0; 2 0,0; 3 2.54,0
SMD10.5X10.3 = smd 3.2 x 1.6: P$1 0,4.05; P$2 0,-4.05
HC49UP = smd 5.334 x 1.93: 1 -4.826,0; 2 4.826,0
SOT95P240X110-3N = smd 1.18 x 0.609: 1 -1.024,0.95; 2 -1.024,-0.95; 3 1.024,0
R0805 = smd 1.3 x 1.5: 1 -0.95,0; 2 0.95,0
R0805W = smd 1.5 x 1: 1 -1.052,0; 2 1.052,0
SPST_NO_SMD = smd 2.108 x 1.397: 1 0,4.496; 2 9.119,4.496; 3 0,0; 4 9.119,0
SJ = smd 1.168 x 1.6: 1 -0.762,0; 2 0.762,0
SJ_2W = smd 1.27 x 2.54: 1 -2.54,0; 2 0,0; 3 2.54,0
SJ_2 = smd 1.168 x 1.6: 1 -1.524,0; 2 0,0; 3 1.524,0
QFP80P900X900X120-32N = smd 1.6 x 0.547: 1 -4.181,2.8; 2 -4.181,2; 3 -4.181,1.2; 4 -4.181,0.4; 5 -4.181,-0.4; 6 -4.181,-1.2; 7 -4.181,-2; 8 -4.181,-2.8; 17 4.181,-2.8; 18 4.181,-2; 19 4.181,-1.2; 20 4.181,-0.4; 21 4.181,0.4; 22 4.181,1.2; 23 4.181,2; 24 4.181,2.8 | smd 0.547 x 1.6: 9 -2.8,-4.181; 10 -2,-4.181; 11 -1.2,-4.181; 12 -0.4,-4.181; 13 0.4,-4.181; 14 1.2,-4.181; 15 2,-4.181; 16 2.8,-4.181; 25 2.8,4.181; 26 2,4.181; 27 1.2,4.181; 28 0.4,4.181; 29 -0.4,4.181; 30 -1.2,4.181; 31 -2,4.181; 32 -2.8,4.181
DIP762W53P254L1969H508Q14B = drill 0.743 pad 1.343: 1 -3.81,7.62; 2 -3.81,5.08; 3 -3.81,2.54; 4 -3.81,0; 5 -3.81,-2.54; 6 -3.81,-5.08; 7 -3.81,-7.62; 8 3.81,-7.62; 9 3.81,-5.08; 10 3.81,-2.54; 11 3.81,0; 12 3.81,2.54; 13 3.81,5.08; 14 3.81,7.62
SOP65P490X95-8N = smd 1.424 x 0.4: 1 -2.219,0.975; 2 -2.219,0.325; 3 -2.219,-0.325; 4 -2.219,-0.975; 5 2.219,-0.975; 6 2.219,-0.325; 7 2.219,0.325; 8 2.219,0.975
QFN50P300X300X80-17T160N = smd 0.86 x 0.264: 1 -1.435,0.75; 2 -1.435,0.25; 3 -1.435,-0.25; 4 -1.435,-0.75; 9 1.435,-0.75; 10 1.435,-0.25; 11 1.435,0.25; 12 1.435,0.75 | smd 0.264 x 0.86: 5 -0.75,-1.435; 6 -0.25,-1.435; 7 0.25,-1.435; 8 0.75,-1.435; 13 0.75,1.435; 14 0.25,1.435; 15 -0.25,1.435; 16 -0.75,1.435 | smd 1.6 x 1.6: 17 0,0
USBMICRO = smd 0.4 x 1.5: P$1 -1.3,0; P$3 0,0; P$4 0.65,0; P$5 1.3,0 | smd 0.4 x 1.55: P$2 -0.65,0 | smd 1.75 x 2.4: P$6 4.77,-3.8; P$8 -4.77,-3.8
JST-XH-06-PACKAGE-LONG-PAD = drill 1.016 long: 1 -6.35,0; 2 -3.81,0; 3 -1.27,0; 4 1.27,0; 5 3.81,0; 6 6.35,0
JST-XH-07-PACKAGE-LONG-PAD = drill 1.016 long: 1 -7.62,0; 2 -5.08,0; 3 -2.54,0; 4 0,0; 5 2.54,0; 6 5.08,0; 7 7.62,0
JST-XH-08-PACKAGE-LONG-PAD = drill 1.016 long: 1 -8.89,0; 2 -6.35,0; 3 -3.81,0; 4 -1.27,0; 5 1.27,0; 6 3.81,0; 7 6.35,0; 8 8.89,0
W237-102 = drill 1.194 long: 1 -2.5,-1.27; 2 2.5,-1.27
JST-XH-02-PACKAGE-LONG-PAD = drill 1.016 long: 1 -1.27,0; 2 1.27,0
JST-XH-03-PACKAGE-LONG-PAD = drill 1.016 long: 1 -2.54,0; 2 0,0; 3 2.54,0

### Placement (x,y rotation side)
AF1  2.54,2.54 0 top
AF2  97.16,96.52 0 top
C1  51.44,26.04 90 top
C2  65.41,29.21 270 top
C3  65.41,34.29 90 top
C4  48.9,29.84 180 top
C5  53.98,26.04 270 top
C6  54.61,56.52 0 top
C7  68.58,57.15 270 top
C8  71.75,41.91 180 top
C9  71.75,44.45 180 top
C10  81.92,29.21 270 top
C11  74.3,27.3 180 top
C12  85.09,45.09 90 top
C13  71.12,33.02 180 top
C14  71.12,30.48 180 top
C15  57.15,45.72 90 top
C16  8.26,21.59 270 top
C17  29.84,21.59 270 top
D1  9.53,6.35 180 top
H1  94.61,57.15 0 top
H2  33.02,8.89 0 top
IC1  48.26,53.98 270 top
IC2  62.87,53.98 270 top
IC3  19.05,19.68 0 top
ISP1  48.26,45.72 90 top
J1  43.18,27.3 270 top
JP1  40.64,21.59 270 top
JP2  40.64,25.4 270 top
JP5  39.37,2.29 0 top
JP6  97.79,67.31 270 top
JP10  26.04,7.62 270 top
L1  18.41,6.35 90 top
Q1  60.96,31.75 90 top
Q2  7.62,70.48 90 top
Q3  38.1,70.48 90 top
Q4  68.58,70.48 90 top
Q5  11.43,70.48 90 top
Q6  41.91,70.48 90 top
Q7  72.39,70.48 90 top
Q8  17.78,70.48 90 top
Q9  48.26,70.48 90 top
Q10  78.74,70.48 90 top
Q11  21.59,70.48 90 top
Q12  52.07,70.48 90 top
Q13  82.55,70.48 90 top
Q14  27.94,70.48 90 top
Q15  58.42,70.48 90 top
Q16  88.9,70.48 90 top
Q17  31.75,70.48 90 top
Q18  62.23,70.48 90 top
Q19  92.71,70.48 90 top
Q20  19.05,50.16 270 top
Q21  13.97,50.16 270 top
Q22  8.89,50.16 270 top
Q23  39.37,50.16 270 top
Q24  34.29,50.16 270 top
Q25  24.13,50.16 270 top
Q26  29.21,50.16 270 top
R1  83.82,51.44 0 top
R2  80.01,60.33 0 top
R3  74.3,60.33 0 top
R4  60.33,46.35 180 top
R6  48.9,26.04 90 top
R7  8.26,66.04 90 top
R8  38.73,66.04 90 top
R9  69.22,66.04 90 top
R10  5.71,66.04 90 top
R11  36.2,66.04 90 top
R12  66.67,66.04 90 top
R13  10.79,66.04 90 top
R14  41.27,66.04 90 top
R15  71.75,66.04 90 top
R16  13.34,66.04 90 top
R17  43.81,66.04 90 top
R18  74.3,66.04 90 top
R19  18.41,66.04 90 top
R20  48.9,66.04 90 top
R21  79.38,66.04 90 top
R22  15.88,66.04 90 top
R23  46.35,66.04 90 top
R24  76.83,66.04 90 top
R25  20.95,66.04 90 top
R26  51.44,66.04 90 top
R27  81.92,66.04 90 top
R28  23.5,66.04 90 top
R29  53.98,66.04 90 top
R30  84.45,66.04 90 top
R31  28.57,66.04 90 top
R32  59.05,66.04 90 top
R33  89.53,66.04 90 top
R34  26.04,66.04 90 top
R35  56.52,66.04 90 top
R36  87,66.04 90 top
R37  31.11,66.04 90 top
R38  61.59,66.04 90 top
R39  92.08,66.04 90 top
R40  33.66,66.04 90 top
R41  64.14,66.04 90 top
R42  94.61,66.04 90 top
R43  20.32,54.61 270 top
R44  15.24,54.61 270 top
R45  10.16,54.61 270 top
R46  40.64,54.61 270 top
R47  35.56,54.61 270 top
R48  17.78,54.61 270 top
R49  12.7,54.61 270 top
R50  7.62,54.61 270 top
R51  38.1,54.61 270 top
R52  33.02,54.61 270 top
R53  25.4,54.61 270 top
R54  30.48,54.61 270 top
R55  22.86,54.61 270 top
R56  27.94,54.61 270 top
R57  63.5,45.72 270 top
R58  54.86,9.27 90 top
R59  59.94,9.27 270 top
R60  57.4,9.27 270 top
R61  47.24,9.27 270 top
R62  52.32,9.27 90 top
R63  49.78,9.27 90 top
RESET  55.88,22.86 180 top
SJ1  39.37,5.71 180 top
SJ2  8.26,13.97 0 top
SJ3  29.21,14.61 180 top
SJ4  85.09,36.2 0 top
SJ5  88.27,27.94 90 top
SJ6  64.77,40.64 180 top
U1  48.26,36.2 90 top
U2  71.75,38.73 180 top
U3  71.75,37.47 270 top
U4  60.33,43.18 180 top
U$1  52.45,5.33 0 top
X1  10.16,41.91 180 top
X2  10.16,33.66 180 top
X3  80.01,56.52 180 top
X4  30.48,41.91 180 top
X5  30.48,33.66 180 top
X6  8.89,85.72 270 top
X7  19.05,85.72 270 top
X8  29.21,85.72 270 top
X9  39.37,85.72 270 top
X10  49.53,85.72 270 top
X11  59.69,85.72 270 top
X12  69.85,85.72 270 top
X13  80.01,85.72 270 top
X14  90.17,85.72 270 top
X15  93.98,38.73 90 top
X16  93.98,26.67 90 top
X18  94.61,5.08 270 top
X19  86.36,5.08 270 top
X20  78.11,5.08 270 top
X21  69.85,5.08 270 top
X22  94.61,15.88 270 top
X23  86.36,15.88 270 top
X24  78.11,15.88 270 top
X25  69.85,15.88 270 top

### Tracks (layer width: path | path; a pad name or v marks a point on that pad's centre or on a via)
+5V  (via drill 0.38)
  Top 0.203: R2.2 81.28,60.33 83.82,60.33 | R4.2 58.26,45.24 | 58.26,45.24 57.79,44.77 C15.1 | 58.26,45.24 58.89,44.62 U4.9 U4.10 58.03,43.43 v57.78,43.18 | v41.27,10.79 41.85,10.22 R61.1 48.88,11.86 48.88,12.33 49.26,12.71 51.66,12.71 54.16,10.22 R58.2 | J1.VCC 43.18,20.46 45.4,22.69 45.4,23.68 45.58,23.86 45.77,23.86 R6.2 48.57,26.66 v46.33,26.66 | U4.13 59.58,40.81 v59.43,40.66 | v62.23,41.29 61.77,41.74 U4.16 | ISP1.2 43.81,45.09 v43.81,42.56 | v45.42,39.03 45.71,38.75 45.71,37.83 46.09,37.45 v46.99,37.45
  Top 0.381: U1.20 48.66,39.55 49.02,39.18 49.53,39.18 | U1.18 50.26,39.55 49.9,39.18 49.53,39.18 | C6.1 54.52,55.66 54.52,55.6 54.87,55.24 58.28,55.24 v58.3,55.23 | v63.36,57.01 64.77,58.42 IC2.16 | v47.62,33.66 47.86,33.42 U1.4 47.86,29.93 C4.2 v46.33,29.84 41.27,29.84 v40.64,29.21 | v49.53,38.73 49.53,39.18 | J1.VCC 41.91,18.41 v40.64,18.41 | U3.6 71.43,34.34 71.03,33.93 71.03,33.88 C13.2 C14.2 | U3.1 72.73,38.45 72.74,38.45
  Top 0.508: C6.1 52.81,57.37 52.81,57.67 52.06,58.42 IC1.16 50.15,58.42 v49.53,57.8 | IC2.16 68.26,58.42 C7.1 71.6,61.12 71.6,61.26 71.87,61.53 79.9,61.53 81.11,60.33 81.28,60.33 | R2.2 83.82,60.33 X3.1 84.77,53.66 R1.2 | C10.+ 81.78,26.1 72.51,26.1 70.17,28.43 C14.2 68.58,30.48 U2.14 | JP10.1 27.94,12.06 29.84,12.06 29.97,12.19 SJ3.1 v40.64,14.61 | v40.64,29.21 41.35,29.92 45.95,29.92 45.96,29.93 47.86,29.93 | U1.20 48.66,41.67 v48.9,41.91 | v49.53,45.72 56.05,45.72 56.21,45.56 56.36,45.56 C15.1 57.78,44.13 v57.78,43.18 | v62.23,39.99 64.76,37.47 v66.67,37.47 71.75,37.47 72.74,38.45
  Bottom 0.203: v41.27,10.79 40.64,11.43 v40.64,14.61 | v46.33,26.66 v46.33,29.84 | v62.23,41.29 61.6,40.66 | v43.81,42.56 43.81,40.64 v45.42,39.03 | 47,37.45 v46.99,37.45
  Bottom 0.381: v58.3,55.23 61.58,55.23 v63.36,57.01
  Bottom 0.508: v40.64,14.61 v40.64,29.21 | v47.62,33.66 47.62,36.83 | v49.53,38.73 47.62,36.83 | v48.9,41.91 48.9,43.29 49.53,43.92 v49.53,45.72 v49.53,57.8 | v57.78,43.18 57.78,42.3 v59.43,40.66 61.6,40.66 61.6,40.62 v62.23,39.99 | U2.14 66.67,32.38 v66.67,37.47 | 47.62,36.83 47,37.45
+12V  (via drill 0.38)
  Top 0.254: R13.2 10.79,67.74 v11.18,68.12 | Q5.2 13.09,69.46 13.34,69.22 v13.34,68.58 | R25.2 20.95,67.91 v21.26,68.21 | Q11.2 23.42,68.58 v23.5,68.58 | R37.2 31.11,67.78 v31.5,68.16 | R14.2 41.27,67.78 v41.66,68.16 | Q6.2 43.57,69.46 43.81,69.22 v43.81,68.58 | Q17.2 33.41,69.46 33.66,69.22 v33.66,68.58 | R26.2 51.44,67.78 v51.82,68.16 | Q12.2 53.73,69.46 53.98,69.22 v53.98,68.58 | R38.2 61.59,67.91 v61.91,68.22 | Q18.2 63.89,69.46 64.14,69.22 v64.14,68.58 | R15.2 71.75,67.91 v72.07,68.22 | Q7.2 74.05,69.46 74.3,69.22 v74.3,68.58 | R27.2 81.92,67.94 v82.21,68.24 | Q13.2 84.21,69.46 84.45,69.22 v84.45,68.58 | R39.2 92.08,67.91 v92.39,68.22 | Q19.2 94.37,69.46 94.61,69.22 v94.61,68.58
  Top 0.508: IC3.1 10.87,13.89 | 10.87,13.89 SJ2.3 10.79,10.16 10.16,9.53 4.45,9.53 | X21.2 X21.1 X20.1 | X20.1 X19.1 | X19.1 X18.1 X18.2 | X19.2 X19.1 | X20.2 X20.1 | v38.73,7.62 38.61,7.49 SJ1.2 35.95,5.71 34.81,4.57 29.08,4.57 | 4.45,9.53 0.64,13.34 0.64,46.35 v2.54,48.26 | 29.08,4.57 JP10.2 | 29.08,4.57 26.42,1.91 5.71,1.91 4.45,3.17 4.45,9.53 | C16.+ 10.23,18.34 10.87,17.7 10.87,13.89 | v5.71,52.7 5.71,54.68 5.5,54.89 5.5,55.6 5.71,55.81 v5.71,63.5
  Bottom 0.508: v38.73,7.62 64.14,7.62 67.94,3.81 X21.2 | v11.18,68.12 10.37,67.31 5.71,67.31 v5.71,63.5 | v2.54,48.26 5.71,51.44 v5.71,52.7
  pour Top: 67.31,8.89 97.79,8.89 97.79,1.91 67.31,1.91
  pour Bottom (rank 2): 95.25,66.04 95.25,69.22 5.08,69.22 5.08,66.04
A
  Top 0.381: X14.5 X13.5 X12.5 X11.5 X10.5 X9.5 X8.5 X7.5 X6.5 3.23,78.79 3.23,52.15 7.99,47.39 17.37,47.39 19.05,49.06 Q20.3
ADSOUND+
  Top 0.381: U3.5 70.78,36.06 71.07,36.35 73.9,36.35 75.12,35.13 76.01,35.13 77.07,36.2 SJ4.1
ADSOUND-
  Top 0.381: U3.8 74.5,33.48 74.5,33.21 75.12,32.59 75.6,32.59 78.5,29.68 88.05,29.68 SJ5.3
AN1  (via drill 0.38)
  Top 0.203: IC1.7 42.56,50.8 v41.29,52.07 | v41.27,59.7 22.52,59.7 22.49,59.73 13.62,59.73 R7.1
  Bottom 0.203: v41.29,52.07 41.27,52.08 v41.27,59.7
AN2  (via drill 0.38)
  Top 0.203: IC2.15 64.76,57.15 v64.14,56.53 | v60.77,60.33 58.24,62.85 23.23,62.85 22.58,63.5 19.05,63.5 18.41,64.14 R19.1
  Bottom 0.203: v64.14,56.53 64.01,56.66 64.01,57.28 63.63,57.66 63.44,57.66 v60.77,60.33
AN3  (via drill 0.38)
  Top 0.203: IC2.1 59.79,60.73 58.31,62.2 v28.57,62.2 | v28.57,63.5 R31.1
  Bottom 0.203: v28.57,62.2 v28.57,63.5
AN4  (via drill 0.38)
  Top 0.203: IC2.2 58.42,57.15 57.78,57.78 57.78,60.96 56.95,61.8 38.98,61.8 v38.73,61.56 | v38.73,63.5 R8.1
  Bottom 0.203: v38.73,61.56 v38.73,63.5
AN5  (via drill 0.38)
  Top 0.203: IC2.3 58.42,55.88 57.15,57.15 57.15,60.96 56.96,61.15 v48.9,61.15 | v48.9,63.5 R20.1
  Bottom 0.203: v48.9,61.15 v48.9,63.5
AN6
  Top 0.203: IC2.4 60.96,54.61 61.42,55.07 61.42,61.77 59.05,64.14 R32.1
AN7
  Top 0.203: IC2.5 61.59,53.34 61.82,53.57 61.82,57.54 66.59,62.31 67.19,62.9 67.94,62.9 69.22,64.17 R9.1
AN8
  Top 0.203: IC2.6 61.59,52.07 62.23,52.7 62.23,57.37 67.36,62.5 77.74,62.5 79.38,64.14 R21.1
AN9
  Top 0.203: IC2.7 61.69,50.8 62.64,51.75 62.64,57.2 67.53,62.09 87.49,62.09 89.53,64.14 R33.1
B
  Top 0.381: X14.6 X13.6 X12.6 X11.6 X10.6 X9.6 X8.6 X7.6 X6.6 3.81,76.83 3.81,52.42 8.26,47.97 9.55,47.97 10.72,49.14 Q21.3
B_COL_0
  Top 0.203: U1.32 38.6,33.4 36.87,35.13 11.39,35.13 9.92,33.66 X2.4
  Bottom 0.203: X2.4 X1.4
B_COL_1
  Top 0.203: U1.1 45.46,31.26 45.09,30.89 9.12,30.89 X2.5
  Bottom 0.203: X1.5 X2.5
B_COL_2
  Top 0.203: X2.6 6.99,30.48 45.72,30.48 46.26,31.02 U1.2
  Bottom 0.203: X2.6 X1.6
B_COL_3  (via drill 0.38)
  Top 0.203: U1.9 50.96,33.4 49.05,35.3 47.07,35.3 v46.83,35.06 | v29.21,35.78 29.43,35.56 36.83,35.56 36.85,35.53 37.03,35.53 38.53,34.04 v40.84,34.04
  Bottom 0.203: X4.4 v29.21,35.78 X5.4 | v40.84,34.04 41.08,34.28 41.08,35.28 42.28,36.47 42.81,36.47 43.84,35.44 46.45,35.44 v46.83,35.06
B_COL_4  (via drill 0.38)
  Top 0.203: U1.10 50.73,34.2 49.22,35.71 46.25,35.71 v45.42,36.53 | v40.44,34.92 38.22,34.92 37.18,35.97 29.93,35.97 29.48,36.42 28.94,36.42 28.08,35.56 26.89,35.56 v26.67,35.78
  Bottom 0.203: X5.5 v26.67,35.78 X4.5 | v45.42,36.53 45.08,36.53 44.74,36.88 42.11,36.88 40.68,35.45 40.68,35.17 v40.44,34.92
B_COL_5  (via drill 0.38)
  Top 0.203: U1.11 50.8,34.99 49.44,36.35 v46.52,36.35 | v40.5,36.18 37.54,36.18 37.34,36.37 30.1,36.37 29.65,36.83 v24.13,36.83
  Bottom 0.203: X4.6 v24.13,36.83 X5.6 | v46.52,36.35 45.59,37.28 41.6,37.28 v40.5,36.18
B_ROW_0
  Top 0.203: X1.1 22.62,41.91 23.69,40.84 32.19,40.84 32.82,41.47 32.82,42.34 33.45,42.98 35.76,42.98 X4.1 45.72,41.91 46.26,41.37 U1.23
B_ROW_1
  Top 0.203: X1.2 15,41.91 16.48,40.44 32.36,40.44 33.83,41.91 X4.2 35.82,40.38 U1.24
B_ROW_2  (via drill 0.38)
  Top 0.203: X4.3 30.72,41.91 29.65,42.98 12.5,42.98 X1.3 | U1.25 32.12,38.99 v31.75,39.37
  Bottom 0.203: v31.75,39.37 X4.3
B_ROW_3  (via drill 0.38)
  Top 0.203: X5.1 35.8,33.66 34.73,34.72 33.85,34.72 32.82,33.69 32.82,33.21 32.19,32.59 23.69,32.59 22.62,33.66 X2.1 | U1.26 43.98,38.1 v36.83,38.1
  Bottom 0.203: v36.83,38.1 X5.1
B_ROW_4  (via drill 0.38)
  Top 0.203: X2.2 14.61,33.66 16.08,32.18 32.82,32.18 X5.2 | U1.27 34.44,37.4 v34.44,37.48
  Bottom 0.203: v34.44,37.48 34.29,37.33 X5.2
B_ROW_5  (via drill 0.38)
  Top 0.203: X2.3 12.46,33.66 13.53,34.72 29.65,34.72 30.72,33.66 X5.3 | U1.28 42.78,36.59 42.55,36.83 31.94,36.83 v31.75,37.02
  Bottom 0.203: v31.75,37.02 X5.3
C
  Top 0.381: X14.7 X13.7 X12.7 X11.7 X10.7 X9.7 X8.7 X7.7 X6.7 4.57,75.06 4.57,52.58 8.01,49.14 Q22.3
D
  Top 0.381: X14.1 X13.1 X12.1 X11.1 X10.1 X9.1 X8.1 X7.1 X6.1 8.89,94.47 0.89,86.47 0.89,51.05 6.89,45.05 35.35,45.05 39.37,49.06 Q23.3
D+
  Top 0.203: JP5.3 40.49,3.4 51.66,3.4 52.45,4.19 U$1.P$3 52.45,6.73 52.7,6.99 53.53,6.99 R58.1 R60.2 R59.2
D-
  Top 0.203: R61.2 R63.1 R62.1 52.32,7.24 51.8,6.72 U$1.P$2 51.8,4.12 51.49,3.81 40.31,3.81 40.26,3.76 38.3,3.76 JP5.2
DTR
  Top 0.203: J1.DTR 47.38,27.3 48.02,27.94 50.48,27.94 C1.2
E
  Top 0.381: X14.2 X13.2 X12.2 X11.2 X10.2 X9.2 X8.2 X7.2 X6.2 1.47,84.66 1.47,51.29 7.13,45.63 30.86,45.63 34.29,49.06 Q24.3
F
  Top 0.381: X14.4 X13.4 X12.4 X11.4 X10.4 X9.4 X8.4 X7.4 X6.4 8.89,86.85 2.64,80.6 2.64,51.78 7.62,46.8 21.87,46.8 24.13,49.06 Q25.3
FTDIRX
  Top 0.203: JP1.2 42.55,21.59 J1.TXO
FTDITX
  Top 0.203: JP2.2 42.55,25.4 J1.RXI
G
  Top 0.381: X14.3 X13.3 X12.3 X11.3 X10.3 X9.3 X8.3 X7.3 9.03,89.53 8.89,89.39 | 8.89,89.39 X6.3 | 8.89,89.39 2.06,82.56 2.06,51.53 7.37,46.22 26.36,46.22 29.21,49.06 Q26.3
GND  (via drill 0.38)
  Top 0.203: R50.1 7.3,55.24 v6.35,55.24 | 17.78,55.88 R48.1 v17.78,57.14 | R55.1 22.86,56.5 v23.5,57.14 | R51.1 38.42,55.56 v39.37,54.61 | R52.1 33.34,55.56 v34.29,54.61 | R56.1 28.89,54.61 v29.21,54.61 | R10.1 6.99,63.82 v6.99,63.5 | v13.34,63.5 R16.1 R22.1 | IC2.8 58.07,49.53 v57.92,49.67 | IC1.8 44.55,48.9 v43.81,48.9 | C6.2 56.55,56.52 v57.04,56.03 | C7.2 69.53,56.2 v69.85,56.52 | R3.1 72.08,59.05 v71.12,59.05 | Q22.2 8.64,51.19 v8.89,51.44 | Q21.2 13.72,51.19 v13.97,51.44 | Q20.2 18.8,51.19 v19.05,51.44 | Q25.2 23.88,51.19 v24.13,51.44 | Q26.2 28.96,51.19 v29.21,51.44 | Q24.2 34.04,51.19 v34.29,51.44 | Q23.2 39.12,51.19 v39.37,51.44 | U3.7 C13.1 v73.66,33.02 | C14.1 73.03,31.43 v73.03,31.75 | C11.2 72.39,28.26 v72.39,28.57 | U4.8 U4.7 60.08,43.43 U4.17 | 61.02,43.88 61.02,44.11 61.08,44.16 U4.5 61.76,44.62 v62.23,45.09 | R57.1 63.72,46.99 v64.77,46.99 | C15.2 56.84,46.67 v55.88,47.62 | C9.1 73.01,44.14 v73.01,43.21 | R49.1 v12.7,57.14 | U1.5 48.66,33.42 v48.9,33.66 | R62.2 50.8,11.74 v50.8,12.06 | R59.1 58.42,11.74 v58.42,12.06 | U4.17 61.02,42.48 61.26,42.48 61.31,42.43 U4.1 62.7,42.43 v62.85,42.28 | U4.15 60.58,42.93 U4.17 | C2.1 v65.41,31.75 C3.1 | U1.21 47.86,41.67 47.3,42.24 46.38,42.24 46.06,42.56 v45.09,42.56 | Q2.2 8.01,69.46 7.62,69.85 v7.62,70.37 | Q8.2 18.17,69.46 17.78,69.85 v17.78,70.37 | Q14.2 28.33,69.46 27.94,69.85 v27.94,70.37 | v33.66,63.5 R40.1 R11.1 | R34.1 R28.1 v23.5,63.5 | R23.1 R17.1 v43.81,63.5 | R35.1 R29.1 v53.98,63.5 | R12.1 R41.1 v64.14,63.5 | R24.1 R18.1 v74.3,63.5 | R36.1 R30.1 v84.45,63.5 | R42.1 v94.61,63.5
  Top 0.254: Q3.2 38.49,69.46 38.1,69.85 v38.1,70.37 | Q9.2 48.65,69.46 48.26,69.85 v48.26,70.37 | Q15.2 58.81,69.46 58.42,69.85 v58.42,70.37 | Q4.2 68.97,69.46 68.58,69.85 v68.58,70.37 | Q10.2 79.13,69.46 78.74,69.85 v78.74,70.37 | Q16.2 89.29,69.46 88.9,69.85 v88.9,70.37
  Top 0.381: v53.98,3.81 53.75,4.03 U$1.P$5 53.75,6.29 v54.21,6.75 | U$1.P$8 46.73,1.53 v46.35,1.91 | v51.44,29.84 C4.1 48.99,30.7 48.99,30.76 48.66,31.09 U1.5
  Top 0.508: v84.45,32.38 84.38,32.46 C10.- 81.84,32.38 v79.38,32.38 | SJ5.1 v88.27,23.5 | RESET.1 55.93,18.41 v57.78,18.41 | C5.1 v53.98,28.57 | SJ2.1 4.45,15.24 v4.45,17.14 | IC3.3 v19.05,12.06 | D1.A v5.71,6.35 | U$1.P$6 58.68,1.53 v59.05,1.91
  other vias: 31.11,28.57 29.84,28.57 28.57,28.57 27.3,28.57 26.04,28.57 24.77,28.57 23.5,28.57 22.23,28.57 20.95,28.57 19.68,28.57 18.41,28.57 17.14,28.57 15.88,28.57 14.61,28.57 13.34,28.57 12.06,28.57 10.79,28.57 9.53,28.57 8.26,28.57 6.99,28.57 5.71,28.57 4.45,28.57 4.45,27.3 4.45,26.04 4.45,24.77 4.45,23.5 4.45,22.23 4.45,20.95 4.45,19.68 4.45,18.41 12.7,27.3 12.7,26.04 12.7,24.77 12.7,23.5 12.7,22.23 12.7,20.95 12.7,19.68 12.7,18.41 12.7,17.14 13.34,16.51 14.61,16.51 15.88,16.51 17.14,16.51 20.95,16.51 22.23,16.51 23.5,16.51 24.77,16.51 25.4,17.14 25.4,18.41 25.4,19.68 25.4,20.95 25.4,22.23 25.4,23.5 25.4,24.77 25.4,26.04 25.4,27.3 32.38,28.57 33.66,28.57 33.66,17.14 33.66,18.41 33.66,19.68 33.66,20.95 33.66,22.23 33.66,23.5 33.66,24.77 33.66,26.04 33.66,27.3
  pour Top (rank 2): 3.81,29.21 34.29,29.21 34.29,15.88 3.81,15.88
  pour Bottom (rank 3): 0,0 0,98.42 0.64,99.06 99.06,99.06 99.69,98.42 99.69,0
LED_B  (via drill 0.38)
  Top 0.203: X3.5 77.47,56.88 78.93,58.34 | 78.93,58.34 82.99,58.34 83.62,57.72 83.62,55.31 79.11,50.8 IC2.10 64.56,50.8 61.44,47.68 57.28,47.68 54.16,50.8 53.34,50.8 | R2.1 78.93,60.2 78.93,58.34 | IC1.10 53.34,50.8 | 53.34,50.8 v53.34,50.18 | U1.22 47.06,39.3 v47.62,38.73 | v54.61,42.26 54.23,41.88 v50.19,41.88
  Bottom 0.203: v53.34,50.18 53.34,48.9 54.61,47.62 v54.61,42.26 | v50.19,41.88 50.19,41.3 v47.62,38.73
LED_D_OUT
  Top 0.203: X3.2 85.09,56.21 78.41,49.53 IC2.9
LED_L  (via drill 0.38)
  Top 0.203: X3.4 76.83,53.34 IC2.12 64.14,53.34 63.86,53.06 63.86,51.24 61.1,48.49 57.62,48.49 55.28,50.82 55.28,51.12 v53.2,53.2 53.06,53.34 IC1.12 | R1.1 82.87,53.02 v83.19,53.34 | U1.12 51.2,35.8 v50.8,36.2
  Bottom 0.203: v83.19,53.34 X3.4 | v50.8,36.2 50.8,36.55 50.15,37.2 50.15,37.73 52.69,40.27 52.69,50.45 53.06,50.82 53.06,53.06 v53.2,53.2
LED_O  (via drill 0.38)
  Top 0.203: R3.2 75.56,60.01 75.56,57.15 X3.6 73.03,54.61 IC2.13 64.14,54.61 63.45,53.92 63.45,51.41 60.93,48.9 57.78,48.9 55.69,50.99 55.69,51.62 52.7,54.61 IC1.13 50.63,54.61 v48.73,52.7 | v47.33,42.88 47.66,42.56 49.16,42.56 49.54,42.18 49.54,41.64 49.46,41.56 U1.19
  Bottom 0.203: v47.33,42.88 47.33,43.8 47.14,43.99 47.14,47.45 48.73,49.04 v48.73,52.7
LMSOUND
  Top 0.381: SJ4.3 86.61,40.31 C12.-
MISO  (via drill 0.38)
  Top 0.203: U1.16 54.23,38.99 v54.61,39.37 57.84,39.37 58.25,39.78 59.46,39.78 60.08,40.39 U4.14 | ISP1.1 46.68,44.45 47.8,43.33 49.1,43.33 49.9,42.53 v53.35,42.53
  Bottom 0.203: v54.61,39.37 54.61,39.74 54.6,39.75 54.6,41.29 v53.35,42.53
MOSI  (via drill 0.38)
  Top 0.203: v54.64,38.48 54.35,38.2 U1.15 49.91,38.2 49.8,38.09 47.36,38.09 47.34,38.1 v46.35,38.1 | v55.24,40.02 57.16,40.02 58.89,41.74 U4.12 | IC1.14 49.53,55.88 47.4,53.75 47.4,51.93 46.99,51.52 46.99,48.26 ISP1.4 46.84,45.57 45.26,45.57 44.6,44.91 44.6,43.99 45.26,43.33 46.2,43.33 v46.36,43.17
  Bottom 0.203: v55.24,40.02 55.24,39.65 55.26,39.64 55.26,39.1 v54.64,38.48 | v46.35,38.1 46.35,40.64 46.36,40.65 v46.36,43.17
N$1
  Top 0.203: R49.2 R44.2 15.24,51.51 Q21.1
N$2
  Top 0.203: R50.2 R45.2 10.16,51.51 Q22.1
N$3
  Top 0.203: R51.2 R46.2 40.64,51.51 Q23.1
N$4
  Top 0.203: R52.2 R47.2 35.56,51.51 Q24.1
N$5
  Top 0.203: R48.2 R43.2 20.32,51.51 Q20.1
N$6
  Top 0.203: R55.2 R53.2 25.4,51.51 Q25.1
N$7
  Top 0.203: R56.2 R54.2 30.48,51.51 Q26.1
N$8
  Top 0.203: R7.2 R10.2 6.67,67.94 Q2.1
N$9
  Top 0.254: Q8.1 16.83,67.94 R22.2 R19.2
N$10
  Top 0.203: R31.2 R34.2 26.99,67.94 Q14.1
N$11
  Top 0.203: R8.2 R11.2 37.15,67.94 Q3.1
N$12
  Top 0.203: R20.2 R23.2 47.31,67.94 Q9.1
N$13
  Top 0.203: R32.2 R35.2 57.47,67.94 Q15.1
N$14
  Top 0.203: R9.2 R12.2 67.63,67.94 Q4.1
N$15
  Top 0.203: Q10.1 77.79,67.94 R24.2 R21.2
N$16
  Top 0.203: R33.2 R36.2 87.95,67.94 Q16.1
N$17
  Top 0.203: U1.7 50.26,31.31 50.66,30.91 56.98,30.91 Q1.1 64.07,26.92 C2.2
N$18
  Top 0.203: U1.8 56.4,32.01 Q1.2 64.07,36.58 C3.2
N$19
  Top 0.381: U$1.P$1 51.15,6 50.8,6.35
  Top 0.508: 50.8,6.35 43.81,6.35 43.18,5.71 SJ1.1 40.13,4.5 40.01,4.37 36.37,4.37 JP5.1
N$20
  Top 0.508: X16.1 97.79,26.71 97.79,38.73 95.29,41.23 X15.2
N$21
  Top 0.508: C12.+ 69.92,48.34 U2.8
N$22
  Top 0.381: C11.1 75.25,30.8 U2.1
N$23
  Top 0.381: U3.4 70.78,39.98 69.76,41 69.76,43.41 C9.2
N$24
  Top 0.203: U3.3 71.43,40.38
  Top 0.381: 71.43,40.38 71.43,41.28 C8.2
N$25
  Top 0.203: U4.4 62.76,43.93 R57.2
N$27
  Top 0.203: Q16.3 89.78,71.51 90.81,70.48 90.81,69.85 91.19,69.46 Q19.1 91.76,68.58 90.81,67.62 90.81,65.41 91.12,65.09 R39.1
N$28
  Top 0.203: Q10.3 79.62,71.51 80.64,70.48 80.64,69.85 81.03,69.46 Q13.1 81.6,68.62 80.64,67.66 80.64,65.41 80.96,65.09 R27.1
N$29
  Top 0.203: R15.1 70.8,65.09 70.48,65.41 70.48,67.62 71.44,68.58 Q7.1 70.87,69.46 70.48,69.85 70.48,70.48 69.46,71.51 Q4.3
N$30
  Top 0.203: Q3.3 38.98,71.51 40.01,70.48 40.01,69.85 40.4,69.46 Q6.1 40.96,68.32 40.64,68 40.38,68 40.01,67.62 40.01,65.41 40.32,65.09 R14.1
N$31  (via drill 0.38)
  Top 0.203: v50.8,2.76 51.04,3 51.83,3 53.1,4.27 U$1.P$4
  Bottom 0.203: v50.8,2.76 49.75,3.81 43.43,3.81 JP5.4
N$32
  Top 0.508: IC3.2 17.35,7.82 15.88,6.35 14.61,6.35 L1.P$1 D1.C
N$34
  Top 0.203: R26.1 50.48,65.09 50.16,65.41 50.16,67.62 50.54,68 50.8,68 51.12,68.32 Q12.1 50.55,69.46 50.16,69.85 50.16,70.48 49.14,71.51 Q9.3
N$35
  Top 0.203: R38.1 60.64,65.09 60.33,65.41 60.33,67.62 61.28,68.58 Q18.1 60.72,69.46 60.33,69.85 60.33,70.48 59.3,71.51 Q15.3
N$36
  Top 0.203: R37.1 30.16,65.09 29.84,65.41 29.84,67.62 30.22,68 30.48,68 30.8,68.32 Q17.1 30.23,69.46 29.84,69.85 29.84,70.48 28.82,71.51 Q14.3
N$37
  Top 0.254: Q8.3 18.66,71.51 19.36,70.81 19.36,70.17 20.07,69.46 Q11.1 20.64,68.61 19.82,67.8 19.82,65.27 20,65.09 R25.1
N$38
  Top 0.203: Q2.3 8.5,71.51 8.89,71.12 8.89,70.48 9.91,69.46 Q5.1 10.48,68.32 10.16,68 9.9,68 9.53,67.62 9.53,65.41 9.84,65.09 R13.1
N$39  (via drill 0.38)
  Top 0.203: IC2.14 64.19,55.88 63.04,54.73 63.04,51.58 61.63,50.16 58.65,50.16 57.56,51.26 v56.34,51.26 | IC1.9 54.51,49.53 v54.56,49.48
  Bottom 0.203: v54.56,49.48 v56.34,51.26
N$40  (via drill 0.38)
  Top 0.508: v8.26,12.06 SJ2.2 | IC3.5 22.45,12.29 v22.23,12.06
  Bottom 0.508: v8.26,12.06 10.16,13.97 19.05,13.97 20.95,12.06 v22.23,12.06
N$41
  Top 0.381: 29.84,17.78 C17.+
  Top 0.508: 29.84,17.78 28.45,16.38 SJ3.2 25.42,14.61 25.42,13.36 22.23,10.16 20.75,10.16 | IC3.4 20.75,10.16 | 20.75,10.16 20.75,6.55 20.95,6.35 L1.P$2
RX  (via drill 0.38)
  Top 0.203: U1.30 44.02,34.93 v42.55,34.93 | v41.91,26.05 41.54,26.42 JP2.1 39.6,26.42 v39.34,26.67 | JP1.3 41.54,20.57 v41.91,20.94
  Bottom 0.203: v41.91,26.05 v41.91,20.94 | v42.55,34.93 42.3,34.69 42.28,34.69 41.9,34.31 41.9,31.96 39.59,29.65 39.59,26.91 v39.34,26.67
SCK
  Top 0.203: X3.3 82.28,56.52 77.84,52.07 IC2.11 65.26,52.07 61.27,48.08 57.45,48.08 53.46,52.07 IC1.11 50.16,52.07 49.38,51.28 49.38,46.53 48.26,45.41 ISP1.3 48.97,43.74 49.27,43.74 50.06,42.94 52.84,42.94 53.08,43.18 55.24,43.18 57.15,41.27 | U1.17 54.69,40.38 54.98,40.66 55.51,40.66 55.54,40.64 56.52,40.64 57.15,41.27 | 57.15,41.27 58.16,42.28 58.16,42.61 58.48,42.93 U4.11
SCORE0_1
  Top 0.254: R16.2 11.43,68.89 Q5.3
  Top 0.381: Q5.3 8.89,74.05 X6.8
SCORE0_10
  Top 0.254: R28.2 21.59,68.89 Q11.3
  Top 0.381: Q11.3 19.05,74.05 X7.8
SCORE0_100
  Top 0.203: R40.2 31.75,68.89 Q17.3
  Top 0.381: Q17.3 29.21,74.05 X8.8
SCORE1_1
  Top 0.203: R17.2 41.91,68.89 Q6.3
  Top 0.381: Q6.3 39.37,74.05 X9.8
SCORE1_10
  Top 0.203: Q12.3 52.07,68.89 R29.2
  Top 0.381: Q12.3 49.53,74.05 X10.8
SCORE1_100
  Top 0.203: R41.2 62.23,68.89 Q18.3
  Top 0.381: Q18.3 59.69,74.05 X11.8
SCORE2_1
  Top 0.203: R18.2 72.39,68.89 Q7.3
  Top 0.381: Q7.3 69.85,74.05 X12.8
SCORE2_10
  Top 0.203: R30.2 82.55,68.89 Q13.3
  Top 0.381: Q13.3 80.01,74.05 X13.8
SCORE2_100
  Top 0.203: R42.2 92.71,68.89 Q19.3
  Top 0.381: Q19.3 90.17,74.05 X14.8
SIGA  (via drill 0.38)
  Top 0.203: v22.23,59.08 22.25,59.05 46.33,59.05 48.23,57.15 IC1.15 | v21.59,57.14 20.32,55.87 R43.1
  Bottom 0.203: v22.23,59.08 21.59,58.45 v21.59,57.14
SIGB  (via drill 0.38)
  Top 0.203: IC1.1 37.47,58.42 37.27,58.62 36.39,58.62 36.2,58.43 v15.88,58.43 | v15.88,57.14 15.88,56.2 R44.1
  Bottom 0.203: v15.88,58.43 v15.88,57.14
SIGC  (via drill 0.38)
  Top 0.203: R45.1 10.16,56.52 9.86,56.81 v9.82,56.81 | v10.79,57.78 36.13,57.78 36.56,58.22 37.1,58.22 37.53,57.78 41.97,57.78 42.6,57.15 IC1.2
  Bottom 0.203: v9.82,56.81 v10.79,57.78
SIGD
  Top 0.203: R46.1 41.29,54.91 41.29,54.89 41.7,54.48 41.7,52.92 43.18,51.44 46.33,51.44 46.99,52.1 46.99,55.24 46.35,55.88 IC1.3
SIGE  (via drill 0.38)
  Top 0.203: v36.83,57.57 36.83,57.33 41.85,57.33 42.91,56.27 42.91,54.88 43.18,54.61 IC1.4 | v36.8,55.87 35.87,55.87 R47.1
  Bottom 0.203: v36.83,57.57 36.83,55.89 v36.8,55.87
SIGF
  Top 0.203: R53.1 26.11,55.56 27.47,56.92 41.69,56.92 42.51,56.1 42.51,54.01 43.18,53.34 IC1.5
SIGG
  Top 0.203: R54.1 31.19,55.56 32.14,56.52 41.52,56.52 42.1,55.93 42.1,53.15 43.18,52.07 IC1.6
SOUND+
  Top 0.381: SJ4.2 85.09,34.92 90.81,34.92 92.11,36.23 X15.1
SOUND-
  Top 0.381: SJ5.2 93.34,27.94 93.94,27.94 94.02,27.94 X16.2
SOUND_ATND  (via drill 0.38)
  Top 0.203: v74.47,36.82 74.47,40.14 C8.1 73.66,42.87 73.66,45.33 73.27,45.72 68.69,45.72 68.35,45.38 68.13,45.38 66.18,43.43 | 66.18,43.43 U4.3 | SJ6.1 66.18,41.29 66.18,43.43
  Bottom 0.203: v74.47,36.82 74.47,34.75 U2.2
SOUND_CS  (via drill 0.38)
  Top 0.203: R4.1 60.58,45.66 v60.58,45.37 U4.6 | U1.14 55.19,37.4 v56.52,38.72
  Bottom 0.203: v60.58,45.37 59.05,45.37 56.52,42.83 v56.52,38.72
SOUNDOUT
  Top 0.203: U4.2 63.12,42.93 64.01,42.04 SJ6.2 60.96,40.64 59.69,39.37 58.42,39.37 55.65,36.59 U1.13
TX  (via drill 0.38)
  Top 0.203: U1.31 42.7,34.2 v42.55,34.04 | JP1.1 JP2.3 40.21,24.38 39.75,24.38 v39.37,24.77
  Bottom 0.203: v39.37,24.77 39.99,25.39 39.99,29.48 42.55,32.03 v42.55,34.04
UC_RESET  (via drill 0.38)
  Top 0.203: v42.55,35.82 42.57,35.8 U1.29 45.48,35.8 45.85,35.43 45.85,34.29 | RESET.3 53.98,24.77 C5.2 52.7,25.09 | 52.7,25.09 C1.1 R6.1 47.93,25.09 v46.98,24.13 | v45.85,33.66 45.85,34.29 | v38.94,28.57 40.36,28.57 40.37,28.56 40.91,28.56 40.92,28.57 52.07,28.57 52.7,27.94 52.7,25.09 | v48.78,34.65 48.44,34.3 46.47,34.3 46.45,34.29 45.85,34.29
  Bottom 0.203: v45.85,33.66 46.09,33.41 46.09,33.39 46.98,32.5 v46.98,24.13 | v42.55,35.82 42.3,35.58 42.28,35.58 41.49,34.79 41.49,32.13 39.18,29.82 39.18,28.82 v38.94,28.57 | v48.78,34.65 48.78,37.07 52.07,40.36 52.07,43.18 ISP1.5
UCD+  (via drill 0.38)
  Top 0.203: U1.6 49.46,33.3 49.54,33.39 49.54,33.41 v49.78,33.66 | v51.44,13.36 51.68,13.12 53.8,13.12 56.7,10.22 R60.1
  Bottom 0.203: v49.78,33.66 49.78,15.01 v51.44,13.36
UCD-  (via drill 0.38)
  Top 0.203: R63.2 49.78,11.81 v49.53,12.06 | U1.3 47.06,33.3 46.98,33.39 46.98,33.41 v46.74,33.66
  Bottom 0.203: v49.53,12.06 47.62,13.97 47.62,32.74 46.98,33.39 46.98,33.41 v46.74,33.66
(copper drawn outside any net)
  shapes: Top area x1

### Text on the board
tPlace: EN
tNames: L / e / f / t / 1 | L / e / f / t / 1 / 0 | T / i / m / e / 1 | L / e / f / t / 1 / 0 / 0 | T / i / m / e / 1 / 0 | R / i / g / h / t / 1 | R / i / g / h / t / 1 / 0 | T / i / m / e / 1 / 0 / 0 | R / i / g / h / t / 1 / 0 / 0 | D / E / G / F / A / B / C / + | Serial Data | B Top Left | B Top Right | S1 | - / + | B Bottom Left | B Bottom Right | S2 | S1 | + | EN | FTDI Header | GND | Buttion Board Power
bNames: Tim Chase / Julia Sorrentino / Brad Piva / Josh Steakelum / Fall 2019 / Speed Of Light Controller / github.com/timChase98/SpeedOfLightContoller